# EAGLE board IceCore (EAGLE 7.7.0)
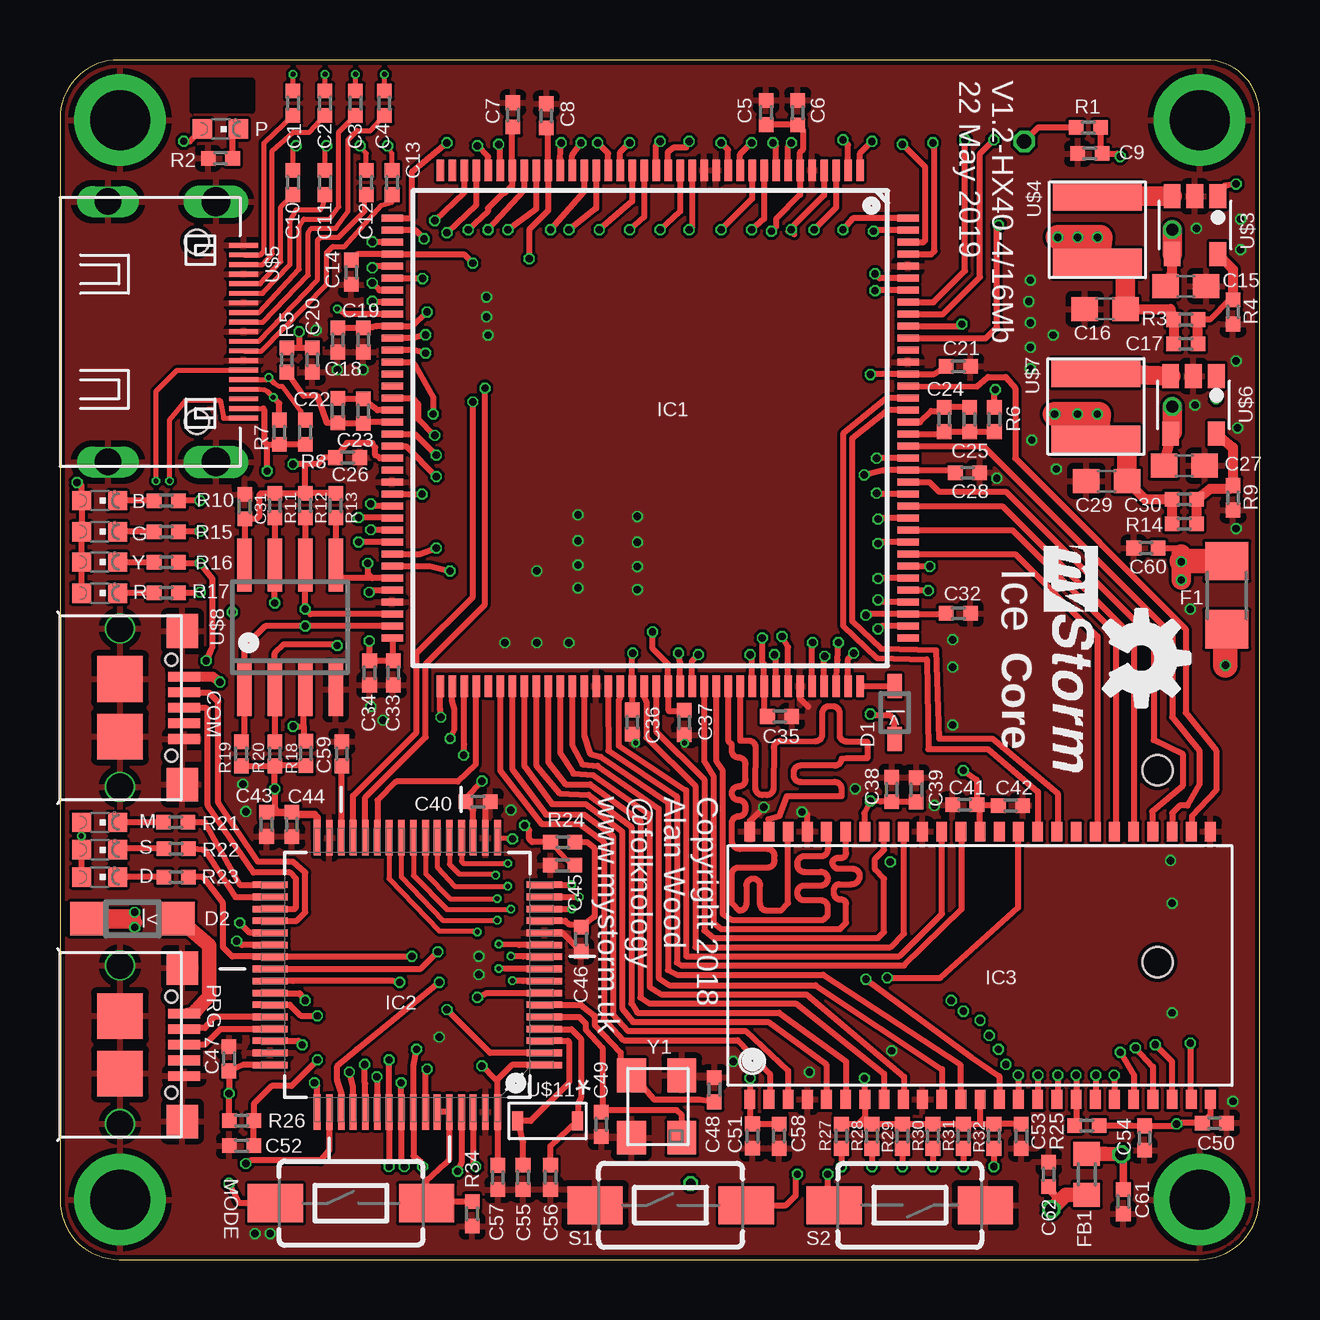
[diagram p2: board, top side]
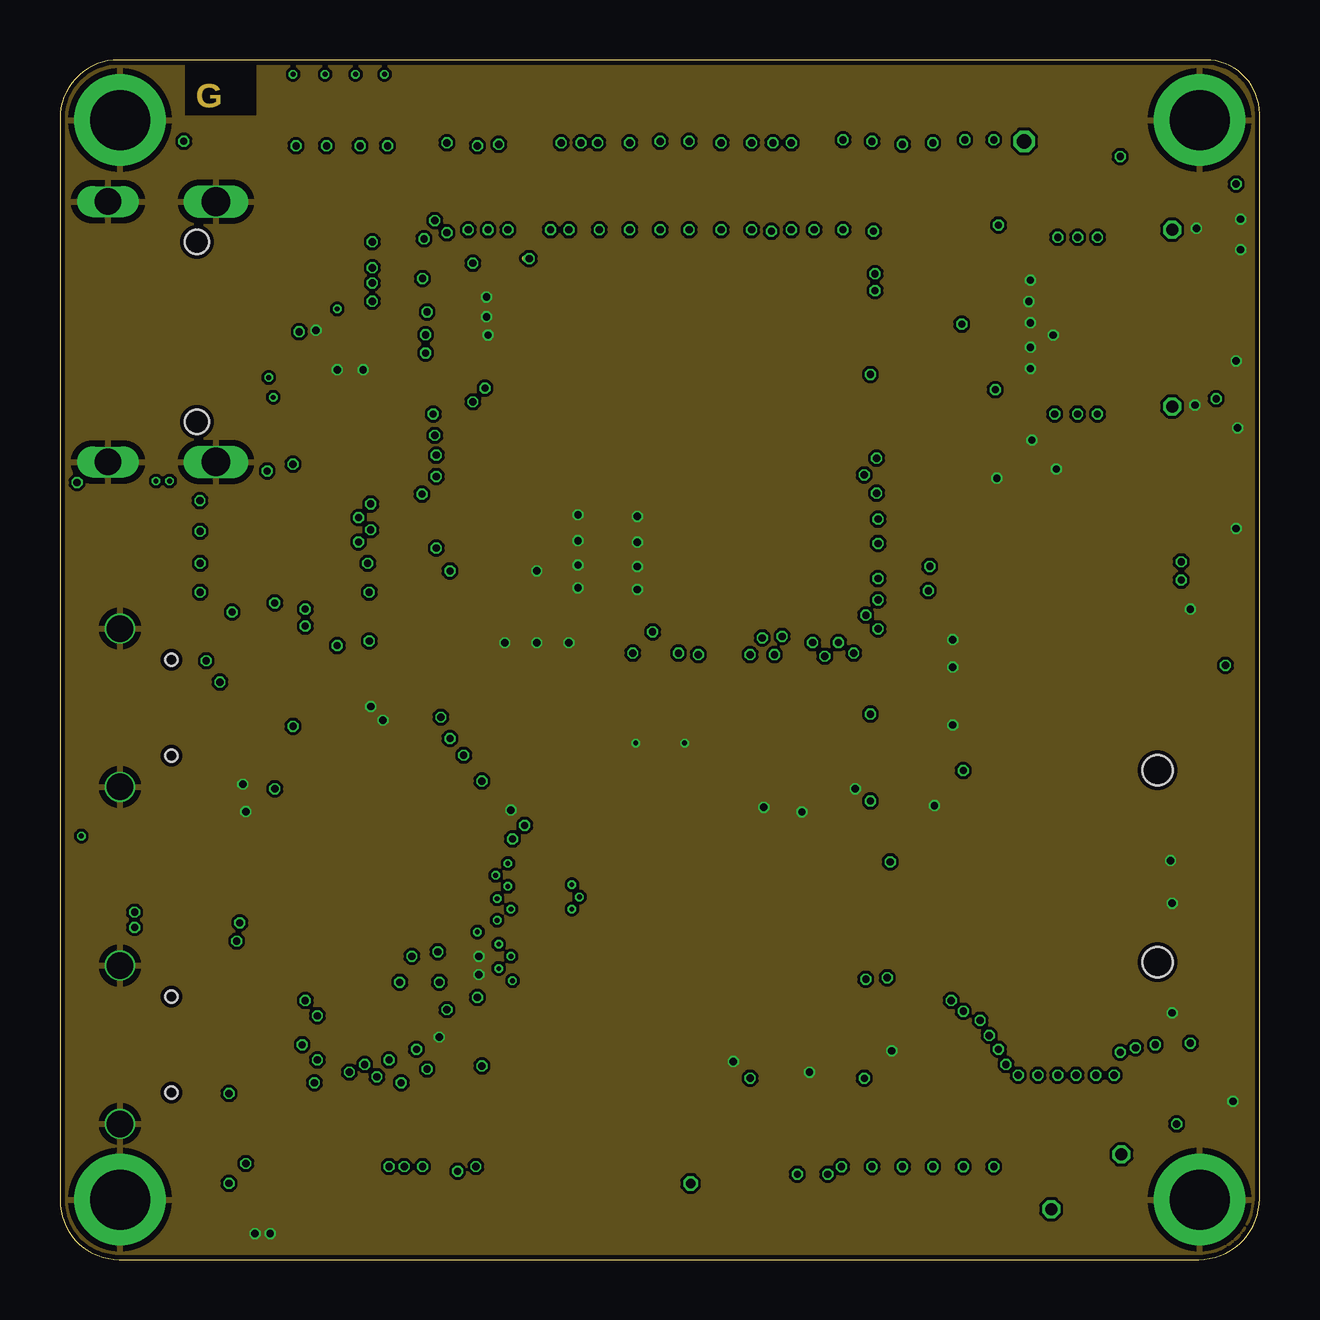
[diagram p3: board, inner layer Route2]
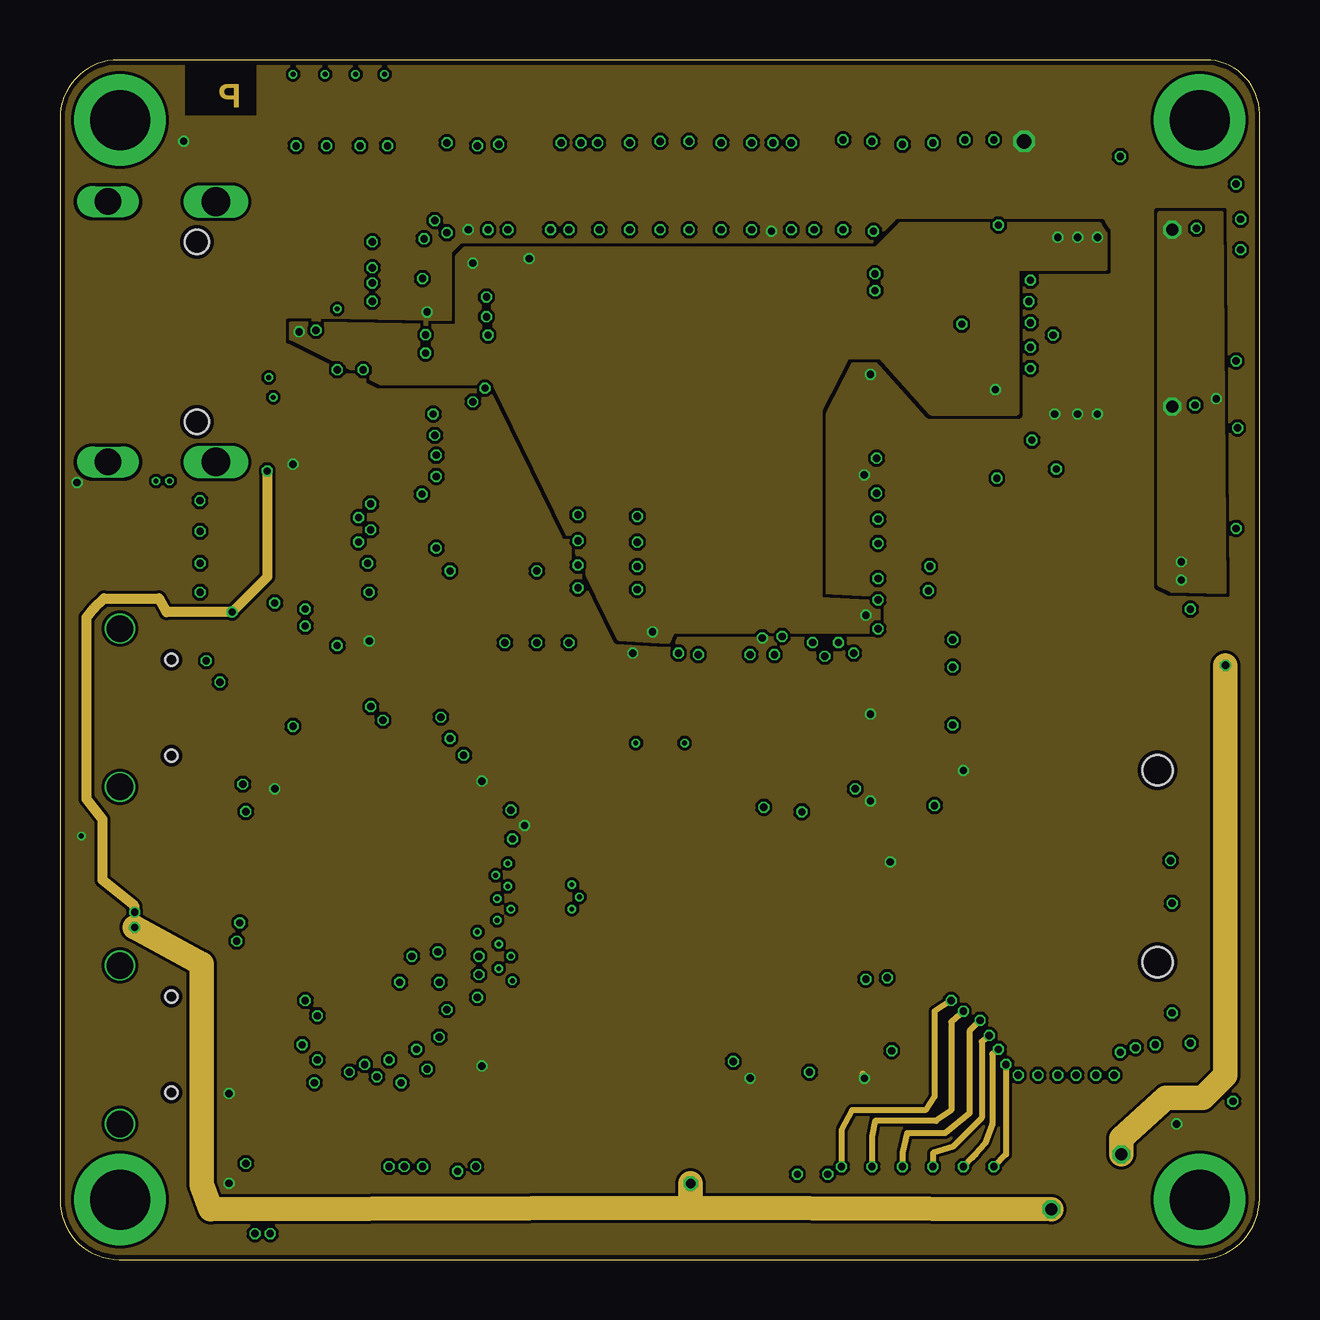
[diagram p4: board, inner layer Route15]
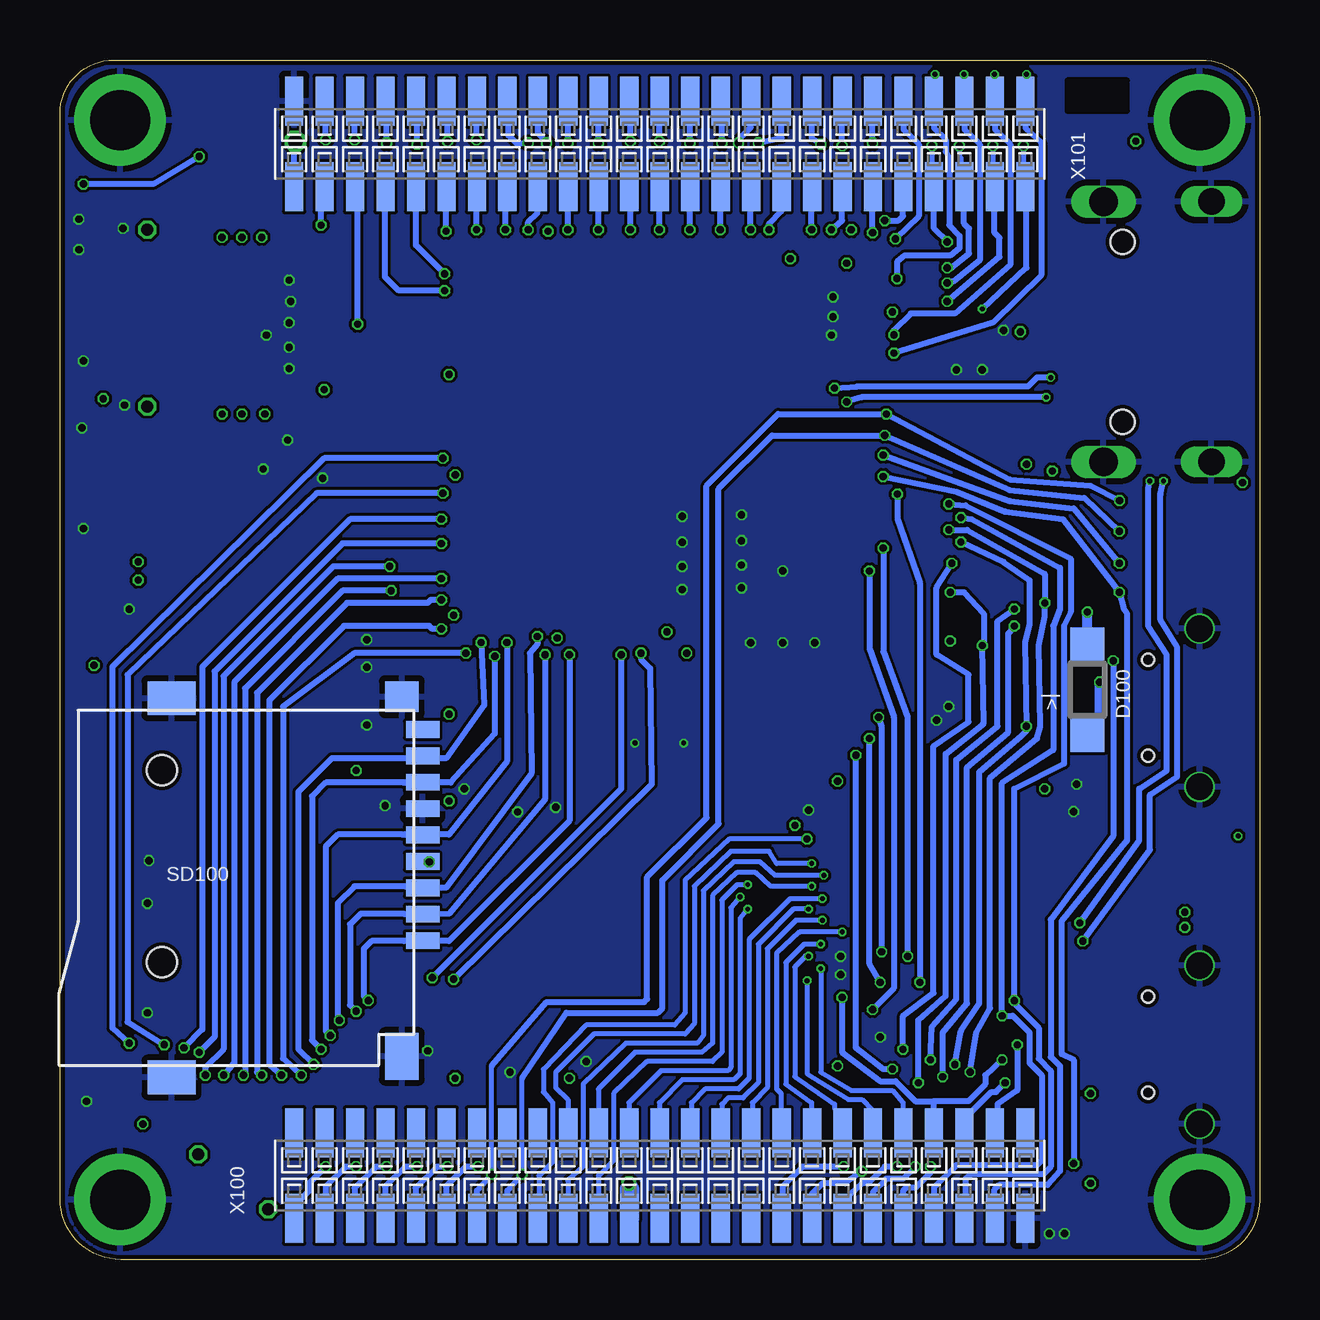
[diagram p5: board, bottom side, seen from below]

Size 50 x 50 mm. Coordinates in mm from the lower left corner, seen from the top.
Outline: 47.76,50 2.44,50 arc90 0,47.56 0,2.47 arc90 2.47,0 47.47,0 arc90 50,2.53 50,47.76 arc90 47.76,50
Copper layers (1*2*15*16): Top 0.035559375mm / dielectric 0.17018125mm / Route2 0.01778125mm / dielectric 47mil / Route15 0.01778125mm / dielectric 0.17018125mm / Bottom 0.035559375mm
Design rules "jcl-4layer": minimum track width 5mil, minimum drill 0.2mm, track to track 5mil, track to pad 5mil, pad to pad 5mil, via to via 5mil, smd to smd 5mil, copper to edge 0.2mm, drill to drill 5mil, minimum pad ring 3mil, minimum via ring 3mil, stop-mask expansion 2.5mil, vias tented up to drill 2mm, thermal gap 10mil
Net classes: 2 thin_power: width 0.254 mm
tRestrict: area 5.5,47.9 to 8,49.1
bRestrict: area 5.5,47.9 to 8,49.1

## Footprints (pad centres in the part's own frame; a part is rotated, then mirrored left to right if it is on the bottom)
CHIPLED_0603 = smd 0.8 x 0.8: A 0,-0.75; C 0,0.75
C0402 = smd 0.61 x 0.61: 1 -0.508,0; 2 0.508,0
C0603 = smd 1.1 x 1: 1 -0.85,0; 2 0.85,0
MICROUSB-B-PEG = smd 0.4 x 1.35: P$1 -1.3,2.675; P$2 -0.65,2.675; P$3 0,2.675; P$4 0.65,2.675; P$5 1.3,2.675 | drill 1.1: SH5 -3.3,0; SH6 3.3,0 | smd 1.4 x 1.3: SH@1 -3.2,2.6; SH@4 3.2,2.6 | smd 1.9 x 1.9: SH@2 -1.2,0; SH@3 1.2,0 | hole 0.5: -2,2.15; 2,2.15
SOD-323 = smd 1 x 0.6: A 1.1,0; C -1.1,0
SOD123 = smd 1.4 x 1.4: A 1.9,0; C -1.9,0
R1206 = smd 1.6 x 1.803: 1 -1.422,0; 2 1.422,0
0603 = smd 1 x 1.1: 1 -0.85,0; 2 0.85,0
TQFP144 = smd 0.9 x 0.3: 1 -10.75,8.75; 2 -10.75,8.25; 3 -10.75,7.75; 4 -10.75,7.25; 5 -10.75,6.75; 6 -10.75,6.25; 7 -10.75,5.75; 8 -10.75,5.25; 9 -10.75,4.75; 10 -10.75,4.25; 11 -10.75,3.75; 12 -10.75,3.25; 13 -10.75,2.75; 14 -10.75,2.25; 15 -10.75,1.75; 16 -10.75,1.25; 17 -10.75,0.75; 18 -10.75,0.25; 19 -10.75,-0.25; 20 -10.75,-0.75; 21 -10.75,-1.25; 22 -10.75,-1.75; 23 -10.75,-2.25; 24 -10.75,-2.75; 25 -10.75,-3.25; 26 -10.75,-3.75; 27 -10.75,-4.25; 28 -10.75,-4.75; 29 -10.75,-5.25; 30 -10.75,-5.75; 31 -10.75,-6.25; 32 -10.75,-6.75; 33 -10.75,-7.25; 34 -10.75,-7.75; 35 -10.75,-8.25; 36 -10.75,-8.75; 73 10.75,-8.75; 74 10.75,-8.25; 75 10.75,-7.75; 76 10.75,-7.25; 77 10.75,-6.75; 78 10.75,-6.25; 79 10.75,-5.75; 80 10.75,-5.25; 81 10.75,-4.75; 82 10.75,-4.25; 83 10.75,-3.75; 84 10.75,-3.25; 85 10.75,-2.75; 86 10.75,-2.25; 87 10.75,-1.75; 88 10.75,-1.25; 89 10.75,-0.75; 90 10.75,-0.25; 91 10.75,0.25; 92 10.75,0.75; 93 10.75,1.25; 94 10.75,1.75; 95 10.75,2.25; 96 10.75,2.75; 97 10.75,3.25; 98 10.75,3.75; 99 10.75,4.25; 100 10.75,4.75; 101 10.75,5.25; 102 10.75,5.75; 103 10.75,6.25; 104 10.75,6.75; 105 10.75,7.25; 106 10.75,7.75; 107 10.75,8.25; 108 10.75,8.75 | smd 0.3 x 0.9: 37 -8.75,-10.75; 38 -8.25,-10.75; 39 -7.75,-10.75; 40 -7.25,-10.75; 41 -6.75,-10.75; 42 -6.25,-10.75; 43 -5.75,-10.75; 44 -5.25,-10.75; 45 -4.75,-10.75; 46 -4.25,-10.75; 47 -3.75,-10.75; 48 -3.25,-10.75; 49 -2.75,-10.75; 50 -2.25,-10.75; 51 -1.75,-10.75; 52 -1.25,-10.75; 53 -0.75,-10.75; 54 -0.25,-10.75; 55 0.25,-10.75; 56 0.75,-10.75; 57 1.25,-10.75; 58 1.75,-10.75; 59 2.25,-10.75; 60 2.75,-10.75; 61 3.25,-10.75; 62 3.75,-10.75; 63 4.25,-10.75; 64 4.75,-10.75; 65 5.25,-10.75; 66 5.75,-10.75; 67 6.25,-10.75; 68 6.75,-10.75; 69 7.25,-10.75; 70 7.75,-10.75; 71 8.25,-10.75; 72 8.75,-10.75; 109 8.75,10.75; 110 8.25,10.75; 111 7.75,10.75; 112 7.25,10.75; 113 6.75,10.75; 114 6.25,10.75; 115 5.75,10.75; 116 5.25,10.75; 117 4.75,10.75; 118 4.25,10.75; 119 3.75,10.75; 120 3.25,10.75; 121 2.75,10.75; 122 2.25,10.75; 123 1.75,10.75; 124 1.25,10.75; 125 0.75,10.75; 126 0.25,10.75; 127 -0.25,10.75; 128 -0.75,10.75; 129 -1.25,10.75; 130 -1.75,10.75; 131 -2.25,10.75; 132 -2.75,10.75; 133 -3.25,10.75; 134 -3.75,10.75; 135 -4.25,10.75; 136 -4.75,10.75; 137 -5.25,10.75; 138 -5.75,10.75; 139 -6.25,10.75; 140 -6.75,10.75; 141 -7.25,10.75; 142 -7.75,10.75; 143 -8.25,10.75; 144 -8.75,10.75
QFP50P1200X1200X160-64N = smd 1.473 x 0.279: 1 -5.715,3.759; 2 -5.715,3.251; 3 -5.715,2.743; 4 -5.715,2.261; 5 -5.715,1.753; 6 -5.715,1.245; 7 -5.715,0.762; 8 -5.715,0.254; 9 -5.715,-0.254; 10 -5.715,-0.762; 11 -5.715,-1.245; 12 -5.715,-1.753; 13 -5.715,-2.261; 14 -5.715,-2.743; 15 -5.715,-3.251; 16 -5.715,-3.759; 33 5.715,-3.759; 34 5.715,-3.251; 35 5.715,-2.743; 36 5.715,-2.261; 37 5.715,-1.753; 38 5.715,-1.245; 39 5.715,-0.762; 40 5.715,-0.254; 41 5.715,0.254; 42 5.715,0.762; 43 5.715,1.245; 44 5.715,1.753; 45 5.715,2.261; 46 5.715,2.743; 47 5.715,3.251; 48 5.715,3.759 | smd 0.279 x 1.473: 17 -3.759,-5.715; 18 -3.251,-5.715; 19 -2.743,-5.715; 20 -2.261,-5.715; 21 -1.753,-5.715; 22 -1.245,-5.715; 23 -0.762,-5.715; 24 -0.254,-5.715; 25 0.254,-5.715; 26 0.762,-5.715; 27 1.245,-5.715; 28 1.753,-5.715; 29 2.261,-5.715; 30 2.743,-5.715; 31 3.251,-5.715; 32 3.759,-5.715; 49 3.759,5.715; 50 3.251,5.715; 51 2.743,5.715; 52 2.261,5.715; 53 1.753,5.715; 54 1.245,5.715; 55 0.762,5.715; 56 0.254,5.715; 57 -0.254,5.715; 58 -0.762,5.715; 59 -1.245,5.715; 60 -1.753,5.715; 61 -2.261,5.715; 62 -2.743,5.715; 63 -3.251,5.715; 64 -3.759,5.715
TSOP-2-50 = smd 0.45 x 0.8: 1 -9.6,-5.58; 2 -8.8,-5.58; 3 -8,-5.58; 4 -7.2,-5.58; 5 -6.4,-5.58; 6 -5.6,-5.58; 7 -4.8,-5.58; 8 -4,-5.58; 9 -3.2,-5.58; 10 -2.4,-5.58; 11 -1.6,-5.58; 12 -0.8,-5.58; 13 0,-5.58; 14 0.8,-5.58; 15 1.6,-5.58; 16 2.4,-5.58; 17 3.2,-5.58; 18 4,-5.58; 19 4.8,-5.58; 20 5.6,-5.58; 21 6.4,-5.58; 22 7.2,-5.58; 23 8,-5.58; 24 8.8,-5.58; 25 9.6,-5.58; 26 9.6,5.58; 27 8.8,5.58; 28 8,5.58; 29 7.2,5.58; 30 6.4,5.58; 31 5.6,5.58; 32 4.8,5.58; 33 4,5.58; 34 3.2,5.58; 35 2.4,5.58; 36 1.6,5.58; 37 0.8,5.58; 38 0,5.58; 39 -0.8,5.58; 40 -1.6,5.58; 41 -2.4,5.58; 42 -3.2,5.58; 43 -4,5.58; 44 -4.8,5.58; 45 -5.6,5.58; 46 -6.4,5.58; 47 -7.2,5.58; 48 -8,5.58; 49 -8.8,5.58; 50 -9.6,5.58
TACTILE-SWITCH-1101NE = smd 2.3 x 1.6: 1 -3.15,0; 2 3.15,0
R0402 = smd 0.61 x 0.61: 1 -0.508,0; 2 0.508,0
TF-PULL = smd 0.7 x 1.4: 1 -2.2,-7.62; 2 -1.1,-7.62; 3 0,-7.62; 4 1.1,-7.62; 5 2.2,-7.62; 6 3.3,-7.62; 7 4.4,-7.62; 8 5.5,-7.62; 9 6.6,-7.62 | smd 1.4 x 2: S1 -7.9,2.85; S2 7.9,2.85 | smd 1.28 x 1.4: S3 7.96,-6.75 | smd 1.95 x 1.4: S4 -7.025,-6.75 | hole 1.25: -3.1,3.25; 4.9,3.25
2.5MM-HOLE = drill 2.5 pad 3.81: P$1 0,0
TSOP-5/SOT23-5 = smd 0.7 x 1: 1 0.95,1.2; 2 0,1.2; 3 -0.95,1.2; 4 -0.95,-1.2; 5 0.95,-1.2
NRC4018 = smd 1.2 x 3.7: P$1 -1.4,0; P$2 1.4,0
MINI-HDMI = smd 0.2 x 1.2: P$1 -3.6,3.525; P$2 -3.2,3.525; P$3 -2.8,3.525; P$4 -2.4,3.525; P$5 -2,3.525; P$6 -1.6,3.525; P$7 -1.2,3.525; P$8 -0.8,3.525; P$9 -0.4,3.525; P$10 0,3.525; P$11 0.4,3.525; P$12 0.8,3.525; P$13 1.2,3.525; P$14 1.6,3.525; P$15 2,3.525; P$16 2.4,3.525; P$17 2.8,3.525; P$18 3.2,3.525; P$19 3.6,3.525 | drill 1.2 pad 1.35 long: P$20 -5.425,2.375; P$21 5.425,2.375 | drill 1.1 pad 1.3 long: P$22 -5.425,-2.125; P$23 5.425,-2.125 | hole 1: -3.75,1.575; 3.75,1.575
SOIC-8-NARROW = smd 0.6 x 2.2: 1 -1.905,-2.6; 2 -0.635,-2.6; 3 0.635,-2.6; 4 1.905,-2.6; 5 1.905,2.6; 6 0.635,2.6; 7 -0.635,2.6; 8 -1.905,2.6
FC135 = smd 0.45 x 0.8: P$1 -1.25,0; P$2 1.25,0
1296-50 = smd 0.76 x 2.05: 1 -15.24,-1.78; 2 -15.24,1.78; 3 -13.97,-1.78; 4 -13.97,1.78; 5 -12.7,-1.78; 6 -12.7,1.78; 7 -11.43,-1.78; 8 -11.43,1.78; 9 -10.16,-1.78; 10 -10.16,1.78; 11 -8.89,-1.78; 12 -8.89,1.78; 13 -7.62,-1.78; 14 -7.62,1.78; 15 -6.35,-1.78; 16 -6.35,1.78; 17 -5.08,-1.78; 18 -5.08,1.78; 19 -3.81,-1.78; 20 -3.81,1.78; 21 -2.54,-1.78; 22 -2.54,1.78; 23 -1.27,-1.78; 24 -1.27,1.78; 25 0,-1.78; 26 0,1.78; 27 1.27,-1.78; 28 1.27,1.78; 29 2.54,-1.78; 30 2.54,1.78; 31 3.81,-1.78; 32 3.81,1.78; 33 5.08,-1.78; 34 5.08,1.78; 35 6.35,-1.78; 36 6.35,1.78; 37 7.62,-1.78; 38 7.62,1.78; 39 8.89,-1.78; 40 8.89,1.78; 41 10.16,-1.78; 42 10.16,1.78; 43 11.43,-1.78; 44 11.43,1.78; 45 12.7,-1.78; 46 12.7,1.78; 47 13.97,-1.78; 48 13.97,1.78; 49 15.24,-1.78; 50 15.24,1.78
CRYSTAL-3.2X2.5 = smd 1.4 x 1.2: 1 -1.3,-1; 2 1.3,-1; 3 1.3,1.1; 4 -1.3,1.1

## Placement (x,y rotation side)
B  [CHIPLED_0603]  1.65,31.63 270 top
C1  220nf  [C0402]  9.72,48.2 270 top
C2  220nf  [C0402]  11.05,48.2 270 top
C3  220nf  [C0402]  12.32,48.2 270 top
C4  220nf  [C0402]  13.53,48.2 90 top
C5  4u7  [C0402]  29.43,47.81 90 top
C6  100nf  [C0402]  30.75,47.81 90 top
C7  100nf  [C0402]  18.88,47.71 270 top
C8  100nf  [C0402]  20.27,47.67 90 top
C9  100nf  [C0402]  42.93,46.1 0 top
C10  220nf  [C0402]  9.72,44.89 270 top
C11  220nf  [C0402]  11.05,44.89 270 top
C12  220nf  [C0402]  12.76,44.89 270 top
C13  220nf  [C0402]  13.84,44.89 270 top
C14  100nf  [C0402]  12.14,41.15 270 top
C15  22uf  [C0603]  46.93,40.58 180 top
C16  22uf  [C0603]  43.56,39.62 180 top
C17  22pf  [C0402]  46.93,38.16 180 top
C18  100nf  [C0402]  11.58,38.33 270 top
C19  100nf  [C0402]  12.64,38.33 270 top
C20  4u7  [C0402]  10.52,37.5 270 top
C21  100nf  [C0402]  37.45,37.23 0 top
C22  4u7  [C0402]  11.58,35.38 270 top
C23  100nf  [C0402]  12.64,35.36 90 top
C24  100nf  [C0402]  36.86,35.02 270 top
C25  4u7  [C0402]  37.91,35.02 270 top
C26  100nf  [C0402]  11.99,33.43 0 top
C27  22uf  [C0603]  46.86,33.08 180 top
C28  100nf  [C0402]  37.83,32.79 180 top
C29  22uf  [C0603]  43.62,32.45 180 top
C30  22pf  [C0402]  46.86,31.69 180 top
C31  100nf  [C0402]  7.7,31.39 90 top
C32  100nf  [C0402]  37.45,26.93 180 top
C33  4u7  [C0402]  13.89,24.46 270 top
C34  100nf  [C0402]  12.91,24.46 270 top
C35  100nf  [C0402]  30,22.63 0 top
C36  100nf  [C0402]  23.85,22.4 270 top
C37  100nf  [C0402]  26.02,22.38 270 top
C38  100nf  [C0402]  34.67,19.6 90 top
C39  4u7  [C0402]  35.69,19.58 90 top
C40  100nf  [C0402]  17.43,19.09 180 top
C41  4u7  [C0402]  37.71,18.95 180 top
C42  100nf  [C0402]  39.62,18.92 0 top
C43  4u7  [C0402]  8.61,18.14 90 top
C44  4u7  [C0402]  9.66,18.14 270 top
C45  100nf  [C0402]  20.95,16.43 0 top
C46  100nf  [C0402]  21.72,13.35 90 top
C47  100nf  [C0402]  7.05,8.37 270 top
C48  22pf  [C0402]  27.28,7.08 270 top
C49  22pf  [C0402]  22.56,5.63 90 top
C50  100nf  [C0402]  48.12,5.69 0 top
C51  100nf  [C0402]  28.87,5.15 270 top
C52  100nf  [C0402]  7.57,4.74 180 top
C53  100nf  [C0402]  40.07,5.14 90 top
C54  4u7  [C0402]  45.2,5.06 270 top
C55  22pf  [C0402]  19.3,3.43 90 top
C56  22pf  [C0402]  20.45,3.43 90 top
C57  100nf  [C0402]  18.25,3.42 90 top
C58  4u7  [C0402]  29.97,5.14 270 top
C59  4u7  [C0402]  11.75,21.08 90 top
C60  100nf  [C0402]  45.27,29.65 0 top
C61  100nf  [C0402]  44.32,2.41 90 top
C62  100nf  [C0402]  41.21,3.56 270 top
COM  FCI-MICROUSB-B-PEG  [MICROUSB-B-PEG]  2.5,23 270 top
D  [CHIPLED_0603]  1.65,15.94 270 top
D1  BAS70J  [SOD-323]  34.79,22.8 270 top
D2  [SOD123]  3.02,14.2 0 top
D100  [SOD123]  7.18,23.75 270 bottom
F1  [R1206]  48.63,27.69 90 top
FB1  FERRITE_BEAD  [0603]  42.8,3.56 90 top
G  [CHIPLED_0603]  1.65,30.34 270 top
IC1  ICE40HX4K_TQFP144  [TQFP144]  24.6,34.65 270 top
IC2  STM32F103RET6  [QFP50P1200X1200X160-64N]  14.48,11.86 180 top
IC3  SDRAM  [TSOP-2-50]  38.35,12.26 0 top
M  [CHIPLED_0603]  1.65,18.22 270 top
MODE  [TACTILE-SWITCH-1101NE]  12.13,2.35 0 top
P  Blue  [CHIPLED_0603]  6.69,47.12 270 top
R  [CHIPLED_0603]  1.65,27.77 270 top
R1  10k  [R0402]  42.86,47.18 0 top
R2  1k  [R0402]  6.69,45.9 0 top
R3  120k  [R0402]  46.93,39.18 180 top
R4  120k  [R0402]  48.9,39.5 270 top
R5  100R  [R0402]  9.46,37.5 90 top
R6  100R  [R0402]  38.95,35.02 270 top
R7  10k  [R0402]  9.14,34.48 90 top
R8  10k  [R0402]  10.22,34.48 90 top
R9  27k  [R0402]  48.9,31.75 270 top
R10  1K  [R0402]  4.44,31.63 0 top
R11  10k  [R0402]  8.95,31.43 270 top
R12  10k  [R0402]  10.22,31.43 270 top
R13  10k  [R0402]  11.49,31.43 270 top
R14  120k  [R0402]  46.86,30.67 180 top
R15  1K  [R0402]  4.44,30.33 0 top
R16  1k  [R0402]  4.44,29.06 0 top
R17  1k  [R0402]  4.44,27.79 0 top
R18  10k  [R0402]  10.25,21.09 90 top
R19  10k  [R0402]  7.56,21.08 90 top
R20  10k  [R0402]  8.95,21.08 90 top
R21  1K  [R0402]  4.83,18.22 180 top
R22  1K  [R0402]  4.84,17.13 180 top
R23  1K  [R0402]  4.84,15.94 180 top
R24  100R  [R0402]  20.95,17.4 0 top
R25  10k  [R0402]  42.8,5.59 0 top
R26  10k  [R0402]  7.57,5.79 180 top
R27  10k  [R0402]  32.58,5.14 90 top
R28  10k  [R0402]  33.85,5.14 90 top
R29  10k  [R0402]  35.12,5.14 90 top
R30  10k  [R0402]  36.39,5.14 90 top
R31  10k  [R0402]  37.66,5.14 90 top
R32  10k  [R0402]  38.93,5.14 90 top
R34  27k  [R0402]  17.18,1.9 270 top
S  [CHIPLED_0603]  1.65,17.08 270 top
S1  [TACTILE-SWITCH-1101NE]  25.45,2.26 0 top
S2  [TACTILE-SWITCH-1101NE]  35.42,2.26 180 top
SD100  TF-HOLDER  [TF-PULL]  42.5,15.49 90 bottom
U$1  HOLE-2.5MM  [2.5MM-HOLE]  2.5,47.5 0 top
U$2  HOLE-2.5MM  [2.5MM-HOLE]  47.5,47.5 0 top
U$3  [TSOP-5/SOT23-5]  47.31,43.12 0 top
U$4  NRS4018  [NRC4018]  43.24,42.93 270 top
U$5  HD10-001_HDMIMINI-HDMI  [MINI-HDMI]  4.13,38.67 270 top
U$6  [TSOP-5/SOT23-5]  47.24,35.62 0 top
U$7  NRS4018  [NRC4018]  43.18,35.56 270 top
U$8  AT25SDF041A  [SOIC-8-NARROW]  9.59,26.35 0 top
U$10  FCI-MICROUSB-B-PEG  [MICROUSB-B-PEG]  2.5,8.95 270 top
U$11  FC-135  [FC135]  20.32,5.78 180 top
U$12  HOLE-2.5MM  [2.5MM-HOLE]  2.5,2.5 0 top
U$13  HOLE-2.5MM  [2.5MM-HOLE]  47.5,2.5 0 top
X100  1296-T50  [1296-50]  25,3.5 180 bottom
X101  1296-T50  [1296-50]  25,46.5 180 bottom
Y  [CHIPLED_0603]  1.65,29.07 270 top
Y1  12MZ  [CRYSTAL-3.2X2.5]  24.92,6.38 90 top

## Tracks (layer width: path | path; a pad name or v marks a point on that pad's centre or on a via)
2V5
  Top 0.256: IC1.108 D1.C
!CAS  (via drill 0.3)
  Top 0.254: IC1.110 34.21,26.4 v34.1,26.29 | v40.77,7.68 40.77,6.69 IC3.16
  Bottom 0.254: v34.1,26.29 34.48,26.29 34.61,26.42 38.16,26.42 41.27,23.3 41.27,8.13 v40.77,7.68
!CS  (via drill 0.3)
  Top 0.254: IC1.56 14.42,33.9 v15.68,32.64 | v5.84,27.81 5.75,27.79 R17.2 | IC2.50 11.23,4.56 10.86,4.13 7.94,4.13 v7.75,4
  Bottom 0.254: v15.68,32.64 12.64,32 10.6,31.18 8.19,30.86 v5.84,27.81 5.65,27.11 5.52,26.92 5.52,17.46 8.26,14.1 8.26,8.57 7.75,8.32 v7.75,4
!DCS  (via drill 0.3)
  Top 0.254: IC2.58 15.24,7.87 v15.3,7.94 | v16.83,21.02 16.85,21.49 IC1.75
  Bottom 0.254: v15.3,7.94 15.68,7.94 16.83,8.83 v16.83,21.02
!MCS  (via drill 0.3)
  Top 0.254: IC1.113 36.09,27.9 v36.2,27.88 | v42.35,7.68 IC3.18
  Top 0.256: IC3.18 42.35,5.71 R25.1
  Bottom 0.254: v36.2,27.88 38.23,27.88 42.29,23.81 42.29,7.75 v42.35,7.68
!RAS  (via drill 0.3)
  Top 0.254: IC1.112 34.2,27.4 v34.1,27.5 | v41.59,7.68 41.59,6.71 IC3.17
  Bottom 0.254: v34.1,27.5 34.54,27.5 34.67,27.37 38.04,27.37 41.78,23.62 41.78,7.81 v41.59,7.68
!RST/SWDIO  (via drill 0.3)
  Top 0.254: IC2.46 9.93,9.12 v10.1,8.95
  Bottom 0.254: v10.1,8.95 10.1,7.05 10.92,6.48 10.92,5.39 X100.3 10.99,5.32
!SRST  (via drill 0.3)
  Top 0.254: IC2.7 17.77,11.1 v17.4,10.92 | v10.73,8.32 9.65,7.24 8.83,7.24 8.08,6.49 R26.1 C52.1
  Bottom 0.254: v17.4,10.92 17.4,8.64 15.81,7.43 15.18,7.43 14.35,6.6 13.59,6.6 | 13.59,6.6 13.59,5.3 X100.7 | v10.73,8.32 11.43,7.68 11.43,7.3 12.13,6.6 13.59,6.6
!SS  (via drill 0.3)
  Top 0.254: IC1.71 v10.22,26.4 8.56,26.4 7.68,25.53 U$8.1 7.68,21.78 R19.2 | IC2.54 13.23,7.47 v13.21,7.62
  Bottom 0.254: v13.21,7.62 13.21,9.46 12.19,10.67 12.19,20.51 10.48,21.97 10.48,26.08 v10.22,26.4
!WE  (via drill 0.3)
  Top 0.254: IC1.107 32.85,25.04 v33.08,25.27 | v39.94,7.68 IC3.15
  Bottom 0.254: v33.08,25.27 37.72,25.27 40.7,23.05 40.7,8.38 v39.94,7.68
+3V3  (via drill 0.2, 0.3, 0.6)
  Top 0.2: 21.35,16.43 R24.1
  Top 0.254: U$8.8 7.7,28.97 C31.1 8.21,30.88 8.32,30.99 8.32,31.88 8.38,31.94 R11.1 R12.1 | IC2.19 17.22,18.72 C40.2 16.92,19.27 v17.59,19.94 | C57.2 18.24,4.17 IC2.64 18.22,6.16 18.22,7.49 | IC2.48 7.6,8.1 C47.2 v7.05,6.92 7.06,6.91 R26.2 | R.A Y.A G.A B.A 0.9,32.26 v0.71,32.39 | IC1.57 13.34,33.4 13.14,33.53 13.14,33.85 13.02,34.04 11.96,34.04 C26.1 11.01,33.43 10.73,33.15 10.22,33.15 | IC2.1 18.84,8.1 18.22,7.49 | R13.1 R12.1 | 10.22,33.15 v9.71,33.15 | R12.1 10.22,33.15 | C34.1 12.91,25.76 v12.89,25.78 | 18.22,7.49 18.16,7.49 v17.59,8.06 | 9.14,18.64 8.95,18.84 v8.95,19.62 R20.1 | R19.1 R20.1 | R18.1 8.96,20.58 R20.1 | C45.2 21.35,16.43 | R24.1 19.68,17.4 19.56,17.53 19.56,17.91 v19.37,18.1 | MODE.1 7.49,2.35 v7.05,3.17 | IC3.1 28.75,5.77 C51.1 C58.1 | IC3.44 33.54,17.84 33.53,17.84 | IC3.25 47.95,6.03 C50.1 46.58,5.69 v46.54,5.65 | v5.16,46.61 5.42,46.61 P.A | C18.1 C19.1 | D.A S.A 0.89,17.09 v0.89,17.65 M.A | v33.53,7.56 33.55,7.53 IC3.7 33.55,5.93 33.27,5.65
  Top 0.256: C36.1 IC1.89 23.85,25.25 v23.88,25.27 | C35.1 29.35,22.77 IC1.100 29.35,24.82 29.27,24.89 v29.27,25.91 | C28.2 37.22,32.9 IC1.123 34.36,32.9 v33.53,32.7 | C21.1 36.42,36.9 IC1.131 v33.79,36.9 v33.78,36.89 | C7.2 18.85,47.17 IC1.30 18.85,44.76 18.54,44.45 18.48,44.45 17.84,43.81 17.84,43.69 v17.02,42.93 | C34.1 C33.1 13.89,25.86 IC1.72 | IC3.38 38.35,18.82 C41.1 | C42.1 38.25,18.92 C41.1 | 32.51,5.71 R27.2 33.27,5.65 R28.2 R29.2 R30.2 R31.2 38.35,5.65 | C19.1 13.02,38.86 13.18,38.9 IC1.46 14.71,38.9 v15.3,39.5 | v29.65,42.86 29.84,43.05 29.84,43.37 30.85,44.38 IC1.6 30.85,46.15 30.99,46.29 30.99,47.06 C6.1 29.69,47.3 C5.1 | D1.A 34.79,22.49 34.61,22.67 33.84,22.67 v33.78,22.73 | v37.65,20.38 38.22,19.99 C41.1 | C39.1 34.78,19.07 C38.1 34.2,19.09 v33.78,19.11 33.53,18.61 33.53,17.84 33.53,17.65 | R25.2 44.68,5.59 C54.1 46.47,5.57 v46.54,5.65 46.56,5.67 | R1.1 40.77,47.18 v40.2,46.61 | v28.77,7.56 28.75,7.61 IC3.1 | IC3.13 38.35,5.65 | 38.35,5.65 R32.2 C53.2
  Top 0.305: IC2.32 10.72,18.43 10.6,18.54 9.64,18.54 C44.1 9.14,18.64 8.81,18.64 C43.2
  Top 0.406: C29.1 45.24,31.69 C30.2 R14.2
  Top 0.813: 44.58,34.16 44.32,34.16 | 44.32,34.16 43.31,34.16 U$7.P$2 | C29.1 44.47,33.76 44.32,34.16
  Top 1.016: U$7.P$2 43.31,35.24 v41.47,35.24
  Route15 0.254: v33.53,7.56 33.53,7.68 33.47,7.75
  Bottom 0.254: X101.50 40.24,46.56 v40.2,46.61
  Bottom 0.256: SD100.4 34.63,16.59 v34.61,16.57
  other vias: 43.24,35.24 42.42,35.24
  pour Route15 (rank 2): 50,0 0,0 0,50 5.14,50 5.14,47.62 8.26,47.62 8.26,49.97 50,50
+5V  (via drill 0.3, 0.5)
  Top 0.254: C60.2 46.61,29.65 46.61,29.21 v46.74,29.08
  Top 0.256: U$6.1 48.19,36.32 v48.2,35.88
  Top 0.406: C27.2 46.35,34.49 U$6.4 | C15.2 46.35,41.15 U$3.4
  Top 0.813: v46.74,28.32 v46.74,29.08 | v46.74,29.08 46.74,29.4 | 46.77,29.11 v46.74,29.08 | 46.35,34.49 v46.35,35.56 | U$3.4 46.36,42.73 v46.35,42.93
  Top 1.016: F1.2 46.77,29.11
  pour Route15: 48.39,43.62 48.51,27.81 46.35,27.88 45.85,28.13 45.85,43.62
A0  (via drill 0.3)
  Top 0.254: IC1.117 34.16,29.9 v34.1,29.84 | v44.2,8.64 44.77,7.68 44.77,6.69 IC3.21
  Bottom 0.254: v34.1,29.84 38.23,29.84 43.56,24.51 43.56,9.27 v44.2,8.64
A1  (via drill 0.3)
  Top 0.254: IC1.119 34.14,30.9 v34.1,30.86 | IC3.22 45.55,8.04 v44.83,8.83
  Bottom 0.254: v34.1,30.86 37.91,30.86 44.07,24.7 44.07,9.59 v44.83,8.83
A2  (via drill 0.3)
  Top 0.254: IC1.121 34.08,31.9 v34.04,31.94 | IC3.23 46.35,8.26 v45.66,8.95
  Bottom 0.254: v34.04,31.94 39.31,31.94 47.18,24.38 47.18,9.91 v45.66,8.95
A3  (via drill 0.3)
  Top 0.254: IC1.124 v34.04,33.4 | IC3.24 47.12,6.71 v47.12,9.02
  Bottom 0.254: v34.04,33.4 38.99,33.4 47.82,24.7 47.82,9.65 v47.12,9.02
A4
  Top 0.254: IC1.130 38.23,36.39 38.69,36.78 39.42,36.78 39.81,36.32 39.81,33.4 46.93,26.29 46.93,22.8 48.2,21.21 48.2,19.56 47.18,18.48 47.18,17.86 IC3.27
A5
  Top 0.254: IC1.125 38.49,33.9 46.35,26.04 46.35,22.61 47.5,21.21 47.5,19.81 46.99,18.92 46.67,18.92 46.35,18.61 IC3.28
A6
  Top 0.254: IC1.122 36.24,32.4 36.64,32 39.43,32 45.59,25.84 45.59,21.65 46.8,21.08 46.8,19.75 45.53,18.67 IC3.29
A7
  Top 0.254: IC1.120 39.27,31.4 44.77,25.91 44.77,17.85 IC3.30
A8
  Top 0.254: IC1.118 39.7,30.4 44.01,26.1 44.01,17.89 IC3.31
A9
  Top 0.254: IC1.116 39.81,29.4 43.24,25.97 43.24,17.93 IC3.32
A10  (via drill 0.3)
  Top 0.254: IC1.115 v36.25,28.9 v36.26,28.89 | v43.94,7.68 IC3.20
  Bottom 0.254: v36.26,28.89 38.61,28.89 43.18,24.32 43.18,8.76 43.94,8 v43.94,7.68
A11  (via drill 0.3)
  Top 0.254: IC1.114 34.12,28.4 v34.1,28.38 | v43.18,7.68 43.18,6.7 IC3.19
  Bottom 0.254: v34.1,28.38 38.42,28.38 42.74,24.07 42.74,8.19 v43.18,7.68
AN0  (via drill 0.2)
  Top 0.254: IC2.9 18.55,12.12 v18.29,12.13
  Bottom 0.2: v18.29,12.13 18.29,7.81 17.02,7.05 15.3,7.05 14.86,6.54 14.86,5.3
  Bottom 0.254: 14.86,5.3 X100.9
AN1  (via drill 0.2)
  Top 0.254: IC2.8 19.32,11.61 v18.86,11.62
  Bottom 0.2: v18.86,11.62 18.86,7.75 17.14,6.67 16.57,6.67 16.13,6.22 16.13,5.3
  Bottom 0.254: 16.13,5.3 X100.11
AN2  (via drill 0.2)
  Top 0.254: IC2.10 19.32,12.63 v18.8,12.64
  Bottom 0.2: 18.92,12.64 19.37,12.19 19.37,7.62 17.72,6.48 17.72,6.29 17.4,5.97 17.4,5.3
  Bottom 0.254: v18.8,12.64 18.92,12.64 | 17.4,5.3 X100.13
AN3  (via drill 0.2)
  Top 0.254: IC2.11 19.14,13.11 v18.29,13.14
  Bottom 0.2: v18.29,13.14 18.99,13.14 19.75,12.38 19.75,7.3 18.67,6.54 18.67,5.3
  Bottom 0.254: 18.67,5.3 X100.15
AN4  (via drill 0.2)
  Top 0.2: IC2.26 13.72,15.88 15.81,13.69 17.21,13.69 v17.4,13.65
  Bottom 0.2: v17.4,13.65 19.18,13.65 20.13,12.76 20.13,7.11 19.94,6.92 19.94,5.3
  Bottom 0.254: 19.94,5.3 X100.17
AN5  (via drill 0.2)
  Top 0.2: IC2.25 14.22,15.94 15.94,14.14 v18.22,14.14
  Bottom 0.2: v18.22,14.14 19.32,14.14 20.51,12.95 20.51,7.18 21.14,6.54 21.14,5.32
  Bottom 0.254: 21.14,5.32 X100.19
AN6  (via drill 0.2)
  Top 0.2: IC2.24 14.73,16 16.13,14.59 18.73,14.59
  Top 0.254: 18.73,14.59 v18.8,14.61
  Bottom 0.2: v18.8,14.61 19.43,14.61 20.89,13.14 20.89,7.37 21.53,6.73 22.16,6.73 22.42,6.48 22.42,5.32
  Bottom 0.254: 22.42,5.32 X100.21
AN7  (via drill 0.2)
  Top 0.2: IC2.23 15.24,16.07 16.26,15.04 v18.22,15.04
  Bottom 0.2: v18.22,15.04 19.57,15.04 21.27,13.34 21.27,7.56 21.72,7.11 23.11,7.11 23.69,6.54 23.69,5.32
  Bottom 0.254: 23.69,5.32 X100.23
AN8  (via drill 0.2)
  Top 0.254: IC2.14 21.27,14.61 v21.34,14.61
  Bottom 0.2: v21.34,14.61 21.65,14.22 21.65,7.75 21.91,7.49 24.07,7.49 25.02,6.54 25.02,5.3
  Bottom 0.254: 25.02,5.3 X100.25
AN9  (via drill 0.2)
  Top 0.254: IC2.15 21.59,15.12 v21.65,15.11
  Bottom 0.2: v21.65,15.11 22.04,14.67 22.04,8 22.16,7.87 24.96,7.87 26.29,6.54 26.29,5.3
  Bottom 0.254: 26.29,5.3 X100.27
AN10  (via drill 0.2)
  Top 0.254: IC2.16 21.27,15.62 v21.34,15.62
  Bottom 0.2: v21.34,15.62 21.78,15.62 22.42,14.99 22.42,8.64 22.8,8.26 25.53,8.26 26.92,6.92 26.92,4.13 27.56,3.49 27.56,1.96
  Bottom 0.406: 27.56,1.96 27.54,1.96 X100.30
AN11  (via drill 0.2)
  Top 0.2: IC2.22 15.72,16.34 16.45,15.56 v18.67,15.56
  Bottom 0.2: v18.67,15.56 20.38,15.56 21.02,16.13 21.78,16.13 22.8,15.18 22.8,9.02 23.24,8.64 26.04,8.64 27.56,7.11 27.56,5.3
  Bottom 0.254: 27.56,5.3 X100.29
AN12  (via drill 0.2)
  Top 0.2: IC2.21 16.23,16.47 16.64,16.07 18.03,16.07 v18.16,16.01
  Bottom 0.2: v18.16,16.01 20.2,16.01 20.83,16.57 21.91,16.57 23.18,15.37 23.18,9.34 23.43,9.02 26.42,9.02 28.19,7.3 28.19,3.87 28.83,3.3 28.83,1.83
  Bottom 0.406: 28.83,1.83 28.81,1.83 X100.32
AN13  (via drill 0.2)
  Top 0.2: IC2.20 16.74,16.6 16.83,16.51 v18.67,16.51
  Bottom 0.2: v18.67,16.51 20.13,16.51 20.45,17.02 22.04,17.02 23.56,15.56 23.56,9.84 23.94,9.4 27.75,9.4 29.34,7.81 29.34,7.18 28.83,6.67 28.83,5.3
  Bottom 0.254: 28.83,5.3 X100.31
AN14  (via drill 0.3)
  Top 0.2: IC2.17 18.81,17.58 v18.86,17.53
  Bottom 0.2: v18.86,17.53 22.1,17.53 23.94,15.81 23.94,10.29 24.38,9.78 28.07,9.78 29.84,7.94 29.84,6.99 29.46,6.54 29.46,4.06 30.04,3.49 30.04,1.74
  Bottom 0.406: 30.04,1.74 30.08,1.74 X100.34
AN15
  Bottom 0.256: 30.1,5.3 X100.33
AN19
  Bottom 0.256: 35.18,5.26 X100.41
CEC  (via drill 0.2, 0.3)
  Top 0.2: v4,32.45 4,36.2 4.88,37.07 U$5.P$14
  Top 0.254: IC2.38 7.59,13.11 v7.37,13.27
  Bottom 0.254: v7.37,13.27 4.57,17.08 4.57,19.37 3.43,20.13 3.43,25.53 4.13,26.67 4.13,31.88 v4,32.45
CKE
  Top 0.254: IC1.128 34.51,35.4 33.02,34.23 33.02,26.61 34.23,25.46 36.51,25.4 36.64,21.72 38.86,21.72 41.59,19.43 41.59,17.87 IC3.34
CLK
  Top 0.254: IC1.129 34.44,35.9 32.64,34.42 32.64,26.42 34.04,25.08 36.13,25.02 36.2,21.27 38.67,21.27 40.77,19.49 40.77,17.85 IC3.35
CRX/SCL  (via drill 0.3)
  Top 0.254: IC2.61 16.74,4.03 v16.57,3.68
  Bottom 0.254: v16.57,3.68 17.27,3.17 18.22,3.17 18.65,2.75 X100.16
CTX/SDA  (via drill 0.3)
  Top 0.254: IC2.62 17.22,3.92 v17.34,3.87
  Bottom 0.254: v17.34,3.87 19.05,3.87 19.88,3.05 19.88,1.76 X100.18
DONE  (via drill 0.3)
  Top 0.254: IC1.65 14.99,29.4 v15.68,29.65 | v14.67,12.64 14.72,12.63 IC2.39 7.19,12.63 6.79,13.02 6.79,14.86 5.97,15.94 R23.1
  Bottom 0.254: v15.68,29.65 15.68,25.34 14.67,22.61 v14.67,12.64
DQ0
  Top 0.254: IC1.78 18.35,20.38 20.07,18.16 21.65,18.16 22.67,17.4 22.67,10.03 23.5,9.14 28.26,9.14 29.59,7.75 29.59,6.71 IC3.2
DQ1
  Top 0.254: IC1.79 18.85,20.46 20.26,18.54 21.84,18.54 23.05,17.65 23.05,10.22 23.69,9.53 28.57,9.53 30.35,7.87 IC3.3
DQ2
  Top 0.254: IC1.80 19.35,20.59 20.51,18.99 21.91,18.99 23.43,17.84 23.43,10.48 23.88,9.91 29.53,9.91 31.94,8.13 IC3.5
DQ3
  Top 0.254: IC1.81 19.85,20.6 20.83,19.43 22.04,19.37 23.81,18.03 23.81,10.67 24.07,10.29 29.97,10.29 32.77,8.26 32.77,6.69 IC3.6
DQ4
  Top 0.254: IC1.82 20.35,20.73 21.08,19.81 22.1,19.81 24.19,18.29 24.19,10.92 24.57,10.67 30.67,10.67 34.35,7.75 34.35,7.69 IC3.8
DQ5
  Top 0.254: IC1.83 20.85,21.12 21.4,20.26 22.23,20.19 24.57,18.54 24.57,11.37 25.08,11.05 31.11,11.05 35.18,7.62 35.18,7.21 IC3.9
DQ6
  Top 0.254: IC1.84 21.35,21.45 21.78,20.64 22.42,20.57 24.96,18.8 24.96,11.75 25.4,11.43 31.5,11.43 36.77,7.94 36.77,6.69 IC3.11
DQ7
  Top 0.254: IC1.85 21.85,21.84 22.1,21.08 22.54,20.95 25.34,19.05 25.34,12.06 25.72,11.87 31.81,11.87 37.53,8.13 37.53,6.7 IC3.12
DQ8
  Top 0.254: IC1.87 22.85,23.19 22.86,21.21 25.72,19.3 25.72,12.38 25.91,12.26 35.18,12.26 37.59,14.61 37.59,17.8 IC3.39
DQ9
  Top 0.254: IC1.88 23.35,23.41 23.29,23.3 23.29,21.42 26.1,19.56 26.1,12.64 34.99,12.64 36.77,14.41 36.77,17.82 IC3.40
DQ10
  Top 0.254: IC1.90 24.35,23.46 24.45,23.24 24.45,21.75 26.48,19.75 26.48,13.02 34.61,13.02 35.18,13.59 35.18,17.81 IC3.42
DQ11
  Top 0.254: IC1.91 24.85,22.01 26.86,20 26.86,13.72 27.24,13.4 34.1,13.4 34.35,13.65 34.35,15.88 33.97,16.26 33.97,16.7 34.35,17.08 IC3.43
DQ12
  Top 0.254: IC1.95 26.85,20.77 27.24,20.13 27.24,14.03 27.56,13.78 32.51,13.78 32.77,14.03 32.77,14.84 arc90 32.54,15 arc-90 32.26,15.29 32.26,15.42 arc-90 32.48,15.64 32.99,15.64 arc90 33.34,15.99 33.34,16 arc90 33.05,16.28 32.48,16.28 arc-90 32.19,16.57 32.19,16.57 arc-90 32.54,16.73 arc90 32.77,16.95 32.77,17.82 IC3.45
DQ13
  Top 0.254: IC1.96 27.35,20.78 27.62,20.38 27.62,14.41 28,14.16 31.81,14.16 32,14.35 32,14.69 arc90 31.72,14.97 31.02,14.97 arc-90 30.73,15.26 30.73,15.3 arc-90 31.02,15.59 31.72,15.59 arc90 32,15.88 arc90 31.72,16.16 31.02,16.16 arc-90 30.73,16.45 30.73,16.52 arc-90 31.02,16.81 31.72,16.81 arc90 32,17.09 32,17.79 IC3.46
DQ14
  Top 0.254: IC1.97 27.85,21.62 28,21.46 28,21.21 arc90 28.29,20.92 arc-90 28.57,20.64 28.57,20.01 arc-90 28.29,19.72 arc90 28,19.44 arc90 28.29,19.15 arc-90 28.57,18.87 28.57,18.76 arc-90 28.29,18.48 arc90 28,18.19 28,17.46 arc90 28.35,17.11 29.5,17.11 arc-90 29.78,16.83 29.78,16.63 arc-90 29.5,16.34 28.29,16.34 arc90 28,16.05 28,14.86 28.32,14.54 arc90 28.61,14.83 28.61,15.59 arc-90 28.89,15.88 28.9,15.88 arc-90 29.18,15.59 29.18,14.83 arc90 29.47,14.54 30.04,14.54 30.35,14.86 IC3.48
DQ15
  Top 0.254: IC1.98 28.35,21.62 28.72,21.62 arc-90 29,21.33 28.99,19.65 arc90 29.27,19.36 29.45,19.36 arc90 29.74,19.65 29.75,21.33 arc-90 30.04,21.61 31.49,21.6 arc90 31.77,21.89 31.78,22.78 arc-90 32.07,23.07 32.21,23.07 arc-90 32.5,22.78 32.49,21.88 arc90 32.77,21.6 33.66,21.59 33.66,20.89 32.77,20.89 32.58,20.87 arc-90 32.29,20.59 30.86,20.59 arc90 30.58,20.3 30.58,20.19 arc90 30.86,19.91 32.29,19.91 arc-90 32.58,19.62 32.58,19.3 30.29,19.3 29.97,18.48 29.53,18.35 29.53,17.86 IC3.49
DSCK
  Top 0.254: IC1.76 17.34,23.89 17.34,20.64 16.59,19.93 14.02,19.93 13.23,19.14 IC2.27
EN/SWCLK  (via drill 0.3)
  Top 0.254: IC2.49 10.72,7.25 v10.6,7.37
  Bottom 0.254: 12.32,5.3 X100.5 12.3,5.86 11.18,6.99 10.99,6.99 v10.6,7.37
GND  (via drill 0.2, 0.3)
  Top 0.254: IC2.12 20.95,13.62 C46.1 | IC2.18 17.73,18.88 C40.1
  Top 0.256: IC1.103 30.85,23.38 31.18,23.05 | IC3.50 28.75,18.27 v29.34,18.85 | IC3.47 31.15,18.56 v30.92,18.66
  other vias: 12.95,23.05 19.88,28.7 12.64,37.08 34.67,8.7 31.24,7.81 24,21.53 39.05,32.57 46.35,14.85 37.21,24.69 37.21,22.28 26.04,21.53 28.07,8.26 8.13,1.08 17.46,12.64 15.81,9.27 7.75,18.67 13.46,22.48 18.8,18.73 8.76,1.08 11.56,37.08 10.67,38.73 33.15,19.62 47.12,27.11 48.9,6.59 21.21,25.71 19.88,25.71 18.54,25.71 46.29,16.63 46.35,10.28 40.51,34.15 41.53,32.95 41.4,38.53 49.09,34.66 49.02,37.46 49.21,43.36 49.21,42.09 17.46,11.87 49.02,30.47 24.07,30.98 24.07,29.9 24.07,28.88 24.07,27.93 21.59,31.04 21.59,29.96 21.59,28.95 21.59,27.99 7.62,19.81 17.78,40.12 17.78,39.3 17.84,38.53 37.21,25.84 40.45,40.82 40.39,39.93 40.45,39.04 40.45,38.03 40.45,37.14 47.37,42.98 47.31,35.61 36.45,18.92
  pour Bottom (rank 2): 0,0 0,50 50,50 50,0
  pour Top: 50,0 0,0 0,50 50,50
  pour Route2 (rank 2): 50,-0.06 0,-0.06 0,49.94 5.14,49.94 5.14,47.62 8.26,47.62 8.26,49.97 50,49.94
HOLD  (via drill 0.3)
  Top 0.254: IC2.52 12.22,7.2 v12.06,7.81 | v8.95,27.37 U$8.7 R11.2 | IC1.63 12.97,30.4 v12.95,30.42
  Bottom 0.254: v12.06,7.81 11.81,9.46 11.24,10.48 11.24,20.07 9.27,21.72 9.14,22.23 9.21,25.59 8.95,26.8 v8.95,27.37 8.95,28.57 12.19,30.42 v12.95,30.42
HPD  (via drill 0.2, 0.3)
  Top 0.2: v4.57,32.45 4.57,34.99 5.27,35.81 6.67,35.81 6.81,35.07 U$5.P$19
  Top 0.254: IC2.37 7.91,13.62 v7.49,14.03
  Bottom 0.254: v7.49,14.03 5.02,17.46 5.02,19.62 3.87,20.38 3.87,25.21 4.64,26.42 4.64,32.13 v4.57,32.45
IO0  (via drill 0.3)
  Top 0.254: 15.88,23.88 IC1.73 15.85,22.95 v15.88,22.61 | IC2.40 15.04,12.12 v15.75,12.83
  Bottom 0.254: v15.75,12.83 15.75,22.23 v15.88,22.61
IO1  (via drill 0.3)
  Top 0.254: 16.38,23.87 IC1.74 16.35,23.27 16.45,22.92 16.45,22.1 v16.26,21.72 | IC2.51 11.73,6.93 11.56,7.49 11.56,8.06 12.38,8.76 v15.81,11.56
  Bottom 0.254: v15.81,11.56 16.26,12.32 v16.26,21.72
L0  (via drill 0.3)
  Top 0.254: IC1.49 14.67,37.4 14.8,37.27 15.56,35.94 v15.56,35.24 | v5.83,31.63 R10.2 | S2.2 32,2.53 v32,3.56
  Bottom 0.2: v32,3.56 32,8.06
  Bottom 0.254: v5.83,31.63 7.05,32.26 10.41,32.51 v15.56,35.24 20.07,35.24 23.05,32.26 23.05,18.41 25.53,15.94 25.53,10.86 25.65,10.73 29.72,10.73 32,8.06 | X100.38 32.62,2.88 v32,3.56
L1  (via drill 0.3)
  Top 0.254: IC1.52 14.71,35.9 14.92,35.69 14.92,35.05 v15.62,34.35 15.68,34.29 | v5.84,30.35 5.63,30.33 R15.2 | S1.2 30.26,2.26 30.67,2.67 30.67,3.43 v30.73,3.56
  Bottom 0.2: v30.73,3.56 30.73,7.56
  Bottom 0.254: v5.84,30.35 7.3,31.75 10.41,32.07 v15.62,34.35 20.32,34.35 22.54,32.13 22.54,18.16 24.89,15.81 24.89,11.11 24.89,10.48 25.08,10.29 28.89,10.29 30.73,7.56 | X100.36 31.35,2.88 v30.73,3.56
L3  (via drill 0.3)
  Top 0.254: IC1.55 14.81,34.4 v15.68,33.53 | R16.2 4.99,29.02 v5.84,29.02 6.35,28.38 6.35,25.53 6.29,25.4 v6.1,24.96
  Bottom 0.254: v15.68,33.53 10.41,31.62 7.75,31.3 v5.84,29.02 | v6.1,24.96 6.1,17.65 8.7,14.16 8.7,8.45 8.32,8.06 8.32,3.68 8.83,3.11 10.86,3.11 11.05,2.92 11.05,1.74 X100.4
LDQM  (via drill 0.3)
  Top 0.254: IC1.93 25.85,24.89 v25.78,25.27 | 39.12,6.71 IC3.14 39.15,7.65 37.97,8.45 v33.59,11.68
  Bottom 0.254: v25.78,25.27 25.78,25.02 25.4,24.64 25.34,19.81 v33.59,11.68
MCLK  (via drill 0.3)
  Top 0.254: v14.16,11.56 13.85,11.62 9.84,11.62 9.71,11.61 IC2.41
  Top 0.256: IC1.60 v15.09,31.9
  Bottom 0.256: v15.09,31.9 15.09,30.86 14.16,28.19 v14.16,11.56
MISO  (via drill 0.3)
  Top 0.254: v14.22,7.37 IC2.56 14.22,4.13 v14.35,3.87 | v11.56,25.59 11.49,25.65 9.34,25.65 8.95,25.27 U$8.2 R20.2 | 13.83,27.88 12.95,27.88 v12.89,27.81
  Top 0.255: 13.83,27.88 IC1.68
  Bottom 0.254: v14.22,7.37 14.22,9.97 13.08,10.99 13.08,21.08 11.56,22.29 11.49,22.35 v11.56,25.59 11.49,25.65 11.49,26.92 12.32,27.81 v12.89,27.81 | v14.35,3.87 14.86,3.37 15.56,3.37 16.11,2.81 X100.12
MODE
  Top 0.254: R21.1 6.03,18.22 7.49,15.62 IC2.33
MODE/BOOT
  Top 0.254: IC2.59 IC2.60 16.23,4.19 16.07,4 15.28,3.28 MODE.2 15.34,2.41 R34.1
MOSI  (via drill 0.3)
  Top 0.254: R13.2 U$8.5 11.49,28.38 11.51,28.4 13.02,28.4 | IC1.67 13.02,28.4 | v14.86,8.76 14.73,8.06 IC2.57 14.73,4.32 15.05,4.06 v15.11,3.87 | v12.83,29.02 12.83,28.59 13.02,28.4
  Bottom 0.254: v14.86,8.76 14.86,10.16 13.59,11.11 13.59,21.4 12.13,22.42 12.13,24.38 13.46,25.21 13.46,28 v12.83,29.02 | v15.11,3.87 15.62,3.87 16.32,3.17 16.57,3.17 17.27,2.54 17.27,1.93 X100.14
N$1
  Top 0.254: R2.2 7.2,46.75 P.C
N$2
  Top 0.254: R22.2 2.45,17.13 S.C
N$3
  Top 0.256: IC1.126 36.75,34.4 C24.2 C25.2 R6.2
N$4
  Top 0.254: R21.2 M.C
N$5
  Top 0.254: IC2.4 21.32,9.6 21.72,9.21 21.72,6.73 21.59,6.48 21.59,5.8 U$11.P$1 20.45,4.72 C56.2
N$6
  Top 0.256: C22.1 12.43,35.89 C23.2 13.24,35.4 IC1.53
N$7
  Top 0.254: IC2.6 21.7,10.62 22.29,10.16 22.29,9.78 23.37,8.63 23.37,8.07 23.37,8.06 Y1.3 23.88,7.68 24.77,6.67 26.67,6.67 C48.2
N$8  (via drill 0.3)
  Top 0.256: R1.2 43.37,46.16 C9.2 44.07,46.1 v44.2,45.97 | v49.02,44.83 48.57,44.76 U$3.1
  Bottom 0.256: v44.2,45.97 46.1,44.83 v49.02,44.83
N$9
  Top 0.254: R10.1 B.C
N$10
  Top 0.254: 19.11,5.8 U$11.P$2 | IC2.3 21.17,9.12 21.21,9.08 21.21,7.37 19.62,5.78 U$11.P$2 | C55.2 19.3,4.89 19.11,5.74 U$11.P$2
N$11
  Top 0.254: R15.1 G.C
N$12
  Top 0.254: R16.1 Y.C
N$13  (via drill 0.3)
  Top 0.406: COM.P$1 6.37,24.3 v6.67,24.07
  Bottom 0.406: v6.67,24.07 6.67,22.42 6.79,22.29 6.79,22.23 D100.A
N$14
  Top 0.256: C25.1 C24.1 36.7,35.37 36.32,35.37 35.85,34.9 IC1.127
N$15
  Top 0.254: R17.1 2.41,27.79 R.C
N$16  (via drill 0.3, 0.5)
  Top 0.305: C61.2 44.32,4.3 v44.24,4.38
  Top 0.61: FB1.2 43.57,4.41 v44.24,4.38
  Top 1.016: F1.1 48.57,25.73 v48.58,24.77
  Route15 1.016: v48.58,24.77 48.58,7.68 47.62,6.73 46.1,6.73 44.24,5.06 v44.24,4.38
N$18
  Top 0.256: IC1.54 12.5,34.9 C23.1 11.41,34.85 C22.2 11.13,34.87 10.73,36.01 10.16,36.01 R5.1
N$19
  Top 0.254: IC2.5 21.64,10.11 21.91,9.84 21.91,9.59 22.61,8.83 22.61,6.18 | Y1.1 25.92,6.02 25.72,6.22 22.65,6.22 22.61,6.18 | 22.61,6.18 C49.2
N$22
  Top 0.254: R23.2 D.C
N$56
  Top 0.813: U$3.3 43.38,44.32 U$4.P$1
N$91
  Top 0.254: R4.1 48.77,40.01 47.94,39.18 R3.1
  Top 0.406: C17.1 R3.1 | U$3.5 48.9,41.28 R4.1
N$93
  Top 0.406: R14.1 C30.1 47.94,32.13 48.77,32.13 R9.1 48.9,33.85 U$6.5
N$94
  Top 0.813: U$6.3 43.32,36.95 U$7.P$1
ODM
  Top 0.254: IC2.35 9.78,14.61 9.84,14.67 9.84,15.88 9.59,16.13 8.06,16.13 6.16,18.92 6.16,22.92 6.1,22.99 5.19,22.99 COM.P$3
ODP
  Top 0.254: IC2.36 9.87,14.12 10.22,14.48 10.22,16.13 9.72,16.57 8.26,16.57 6.6,19.05 6.6,23.24 6.22,23.62 5.2,23.62 COM.P$2
P0  (via drill 0.2, 0.3)
  Top 0.2: C1.1 v9.72,49.4
  Top 0.256: v15.24,37.78 14.73,37.91 IC1.48
  Bottom 0.2: v9.72,49.4 9.72,48.33 X101.1
  Bottom 0.256: X101.1 9.76,47.16 9.1,46.55 9.1,41.02 11.11,39.05 v15.24,37.78
P1  (via drill 0.2, 0.3)
  Top 0.2: C2.1 v11.05,49.4
  Top 0.256: v15.24,38.54 14.71,38.4 IC1.47
  Bottom 0.2: 10.35,46.42 10.39,46.48 | v11.05,49.4 11.05,48.3 X101.3
  Bottom 0.256: X101.3 11.03,47.1 10.39,46.48 10.39,41.47 12.7,39.43 14.54,39.43 15.24,38.73 v15.24,38.54
P2  (via drill 0.2 pad 0.3, 0.3)
  Top 0.2: C10.1 9.72,46.29 v9.84,46.42
  Top 0.254: IC1.45 11.9,39.4 v11.56,39.62
  Bottom 0.2: v9.84,46.42 9.84,44.8 X101.2
  Bottom 0.254: v11.56,39.62 9.72,41.34 9.72,44.67 X101.2
P3  (via drill 0.3, 0.3 pad 0.3)
  Top 0.2: C11.1 11.05,46.35 v11.11,46.42
  Top 0.254: IC1.44 13.06,39.9 v13.02,39.94
  Bottom 0.2: v11.11,46.42 11.11,44.8 X101.4
  Bottom 0.254: v13.02,39.94 10.84,41.8 10.84,42.59 11.05,42.8 X101.4
P4  (via drill 0.2, 0.3)
  Top 0.2: C3.1 v12.32,49.4
  Top 0.256: v13.02,40.7 13.32,40.4 IC1.43
  Bottom 0.2: v12.32,49.4 12.32,48.3 X101.5
  Bottom 0.256: X101.5 12.3,47.1 11.66,46.48 11.66,41.66 12.76,40.77 12.95,40.77 v13.02,40.7
P5  (via drill 0.2, 0.3)
  Top 0.2: C4.2 v13.53,49.4
  Top 0.256: v15.11,40.89 IC1.42
  Bottom 0.2: v13.53,49.4 13.53,48.33 X101.7
  Bottom 0.256: X101.7 13.57,47.16 13.08,46.67 13.08,46.18 12.93,45.91 12.93,43.12 12.51,42.67 12.51,42.16 12.89,41.85 14.8,41.85 15.11,41.59 v15.11,40.89
P6  (via drill 0.3, 0.3 pad 0.3)
  Top 0.2: C12.1 12.76,46.1 v12.51,46.42
  Top 0.254: IC1.41 13.08,41.4 v13.02,41.34
  Bottom 0.2: v12.51,46.42 12.51,45.97 12.45,45.91 12.45,44.87 X101.6
  Bottom 0.254: v13.02,41.34 12.83,41.34 12.76,41.4 12.11,41.93 12.11,42.97 12.32,43.18 X101.6
P7  (via drill 0.3, 0.3 pad 0.3)
  Top 0.2: C13.1 13.84,46.1 v13.65,46.42
  Top 0.254: IC1.39 13.04,42.4 v13.02,42.42
  Bottom 0.2: v13.65,46.42 13.65,45.09 13.53,44.96 13.53,44.76 X101.8
  Bottom 0.254: 13.57,42.97 X101.8
  Bottom 0.256: 13.57,42.97 v13.02,42.42
P8  (via drill 0.3)
  Top 0.256: v15.18,42.55 14.82,42.9 IC1.38
  Bottom 0.256: X101.9 14.84,47.1 14.21,46.48 14.21,43.5 v15.18,42.55
P9  (via drill 0.3 pad 0.3)
  Top 0.254: IC1.37 14.57,43.4 14.67,43.5 14.67,45.34 v16.13,46.55
  Bottom 0.254: v16.13,46.55 16.13,48.26 X101.11
P10  (via drill 0.3 pad 0.3)
  Top 0.254: IC1.34 16.85,44.47 v15.62,43.31
  Bottom 0.254: v15.62,43.31 15.05,43.31 14.86,43.5 14.86,44.7 X101.10
P11  (via drill 0.3 pad 0.3)
  Top 0.254: IC1.33 17.35,43.96 v16.13,42.8
  Bottom 0.254: v16.13,42.8 16.13,44.7 X101.12
P12  (via drill 0.3 pad 0.3)
  Top 0.254: IC1.32 17.85,45.97 v17.4,46.42
  Bottom 0.254: v17.4,46.42 17.4,48.26 X101.13
P13  (via drill 0.3 pad 0.3)
  Top 0.254: IC1.31 18.35,46.42 v18.29,46.48
  Bottom 0.254: v18.29,46.48 18.65,46.72 X101.15
P14  (via drill 0.3 pad 0.3)
  Top 0.254: IC1.29 19.35,44.56 v17.84,42.93
  Bottom 0.254: v17.84,42.93 17.4,43.31 17.4,44.7 X101.14
P15  (via drill 0.3 pad 0.3)
  Top 0.254: IC1.28 19.85,43.79 v18.67,42.93
  Bottom 0.254: v18.67,42.93 18.67,44.7 X101.16
P16  (via drill 0.3 pad 0.3)
  Top 0.254: IC1.26 20.85,45.89 v20.89,46.55
  Bottom 0.254: v20.89,46.55 19.92,46.76 X101.17
P17  (via drill 0.3 pad 0.3)
  Top 0.254: IC1.25 21.35,46.02 v21.72,46.55
  Bottom 0.254: v21.72,46.55 21.72,46.67 21.21,47.18 21.21,48.26 X101.19
P18  (via drill 0.3 pad 0.3)
  Top 0.254: IC1.24 21.85,44.52 v20.45,42.93
  Bottom 0.254: v20.45,42.93 20.45,43.18 19.94,43.69 19.94,44.7 X101.18
P19  (via drill 0.3 pad 0.3)
  Top 0.254: IC1.23 22.35,43.81 v21.21,42.93
  Bottom 0.254: v21.21,42.93 21.21,44.7 X101.20
P20  (via drill 0.3 pad 0.3)
  Top 0.254: IC1.22 22.85,46.11 v22.42,46.55
  Bottom 0.254: v22.42,46.55 22.42,48.24 X101.21
P21  (via drill 0.3 pad 0.3)
  Top 0.254: IC1.21 23.35,46.15 v23.75,46.55
  Bottom 0.254: v23.75,46.55 23.75,48.26 X101.23
P22  (via drill 0.3 pad 0.3)
  Top 0.254: IC1.20 23.85,44.11 v22.48,42.93
  Bottom 0.254: v22.48,42.93 22.48,44.7 X101.22
P23  (via drill 0.3 pad 0.3)
  Top 0.254: IC1.19 24.35,43.46 v23.75,42.93
  Bottom 0.254: v23.75,42.93 23.75,44.7 X101.24
P24  (via drill 0.3 pad 0.3)
  Top 0.254: IC1.18 24.85,46.44 v25.02,46.61
  Bottom 0.254: v25.02,46.61 25.02,48.26 X101.25
P25  (via drill 0.3 pad 0.3)
  Top 0.254: IC1.17 25.35,46.18 25.59,46.35 26.1,46.35 v26.23,46.61
  Bottom 0.254: v26.23,46.61 26.23,48.24 X101.27
P26  (via drill 0.3 pad 0.3)
  Top 0.254: IC1.16 25.85,43.69 v25.02,42.93
  Bottom 0.254: v25.02,42.93 25.02,44.7 X101.26
P27  (via drill 0.3 pad 0.3)
  Top 0.254: IC1.15 26.35,43.05 v26.23,42.93
  Bottom 0.254: v26.23,42.93 26.23,44.67 X101.28
P28  (via drill 0.3 pad 0.3)
  Top 0.254: IC1.12 27.85,46.25 v27.56,46.55
  Bottom 0.254: v27.56,46.55 27.56,48.26 X101.29
P29  (via drill 0.3 pad 0.3)
  Top 0.254: IC1.11 28.35,46.07 v28.83,46.55
  Bottom 0.254: v28.83,46.55 28.83,48.26 X101.31
P30  (via drill 0.3 pad 0.3)
  Top 0.254: IC1.10 28.85,44.22 v27.56,42.93
  Bottom 0.254: v27.56,42.93 27.56,44.7 X101.30
P31  (via drill 0.3 pad 0.3)
  Top 0.254: IC1.9 29.35,43.38 v28.83,42.93
  Bottom 0.254: v28.83,42.93 28.83,44.7 X101.32
P32  (via drill 0.3 pad 0.3)
  Top 0.254: IC1.8 29.85,46.41 v29.72,46.55
  Bottom 0.254: v29.72,46.55 30.08,46.97 X101.33
P33  (via drill 0.3 pad 0.3)
  Top 0.254: IC1.7 30.35,46.42 v30.48,46.55
  Bottom 0.254: v30.48,46.55 30.92,46.48 31.3,46.86 31.3,48.24 X101.35
P34  (via drill 0.3 pad 0.3)
  Top 0.254: IC1.4 31.85,44.36 30.35,42.86 30.61,42.74 v30.48,42.93
  Bottom 0.254: v30.48,42.93 30.48,43.24 30.1,43.62 30.1,44.7 X101.34
P35  (via drill 0.3 pad 0.3)
  Top 0.254: IC1.3 32.35,43.84 v31.43,42.93
  Bottom 0.254: v31.43,42.93 31.43,44.64 X101.36
P36  (via drill 0.3 pad 0.3)
  Top 0.254: IC1.2 32.85,46.46 v32.64,46.67
  Bottom 0.254: v32.64,46.67 32.64,48.26 X101.37
P37  (via drill 0.3 pad 0.3)
  Top 0.254: IC1.1 33.35,46.11 v33.85,46.61
  Bottom 0.254: v33.85,46.61 33.85,48.24 X101.39
P38  (via drill 0.3 pad 0.3)
  Top 0.254: IC1.144 33.05,43.4 v32.64,42.93
  Bottom 0.254: v32.64,42.93 32.64,44.7 X101.38
P39  (via drill 0.3 pad 0.3)
  Top 0.254: IC1.143 33.95,42.9 v33.91,42.86
  Bottom 0.254: v33.91,42.86 33.91,44.7 X101.40
P40  (via drill 0.3 pad 0.3)
  Top 0.254: IC1.142 35.99,42.4 36.07,42.48 36.07,45.53 v35.12,46.48
  Bottom 0.254: v35.12,46.48 35.12,48.24 X101.41
P41  (via drill 0.3 pad 0.3)
  Top 0.254: IC1.141 36.31,41.9 36.45,42.04 36.45,46.48 v36.39,46.55
  Bottom 0.254: v36.39,46.55 36.39,48.24 X101.43
P42  (via drill 0.3 pad 0.3)
  Top 0.254: IC1.139 34.16,40.9 v33.97,41.08
  Bottom 0.254: v33.97,41.08 35.16,42.27 X101.42
P43  (via drill 0.3 pad 0.3)
  Top 0.254: IC1.138 33.99,40.4 v33.97,40.39
  Bottom 0.254: v33.97,40.39 35.88,40.39 36.45,40.96 36.45,44.7 X101.44
P44  (via drill 0.3 pad 0.3)
  Top 0.254: IC1.137 36.41,39.9 37.72,41.21 v37.72,46.67
  Bottom 0.254: v37.72,46.67 37.72,48.26 X101.45
P45  (via drill 0.3 pad 0.3)
  Top 0.254: IC1.136 36.8,39.4 38.35,40.96 38.35,46.1 v38.92,46.67
  Bottom 0.254: v38.92,46.67 38.92,48.24 X101.47
P46  (via drill 0.3 pad 0.3)
  Top 0.254: IC1.135 37.5,38.9 v37.59,38.99
  Bottom 0.254: v37.59,38.99 37.59,44.61 X101.46
P47  (via drill 0.3 pad 0.3)
  Top 0.254: IC1.134 38.59,38.4 39.05,38.86 39.05,43.05 v39.12,43.12
  Bottom 0.254: v39.12,43.12 39.12,44.57 X101.48
PDM
  Top 0.254: IC2.44 6.43,10.11 6.03,9.65 5.22,9.65 U$10.P$2
PDP
  Top 0.254: IC2.45 6.68,9.6 6.03,8.95 U$10.P$3
RESET  (via drill 0.3)
  Top 0.254: IC1.66 15.42,28.9 v16.26,28.7 | IC2.2 17.93,8.61 v16.13,10.41
  Bottom 0.254: v16.26,28.7 16.26,25.46 15.24,22.61 15.24,11.3 v16.13,10.41
RX  (via drill 0.3)
  Top 0.254: IC1.62 13.83,30.92 v12.45,30.92 | IC2.43 9.57,10.62 10.03,10.16 v10.73,10.16
  Bottom 0.254: v12.45,30.92 12,30.86 8.32,28.83 8.32,27.11 8.6,26.42 8.6,21.23 10.73,19.86 v10.73,10.16 10.29,10.16 9.59,9.46 9.59,8.19 9.08,7.68 9.08,4.13 9.27,3.94 12.64,3.94 13.57,3 X100.8
SCK  (via drill 0.3)
  Top 0.254: v13.72,8.32 IC2.55 v13.72,3.87 | R12.2 U$8.6 v10.22,27.11 10.44,26.9 IC1.70
  Bottom 0.254: v13.72,8.32 13.65,9.72 12.64,10.86 12.64,20.83 10.92,22.23 10.92,26.61 v10.22,27.11 | v13.72,3.87 13.72,3.62 14.35,2.98 14.73,2.98 14.86,2.86 14.86,1.74 X100.10
SD0  (via drill 0.3)
  Top 0.254: IC1.105 31.85,25.12 v31.88,25.15
  Top 0.256: R31.1 v37.66,3.87
  Route15 0.256: v39.12,8.76 38.86,8.57 38.86,5.65 38.54,4.83 38.16,4.38 38.04,4.25 v37.66,3.87
  Bottom 0.254: v31.88,25.15 31.88,21.91 33.72,19.88 35.68,19.88 SD100.7 | 38.92,1.76 X100.48
  Bottom 0.256: 35.68,19.88 38.92,19.88 39.5,19.3 39.5,9.14 v39.12,8.76 | v37.66,3.87 38.1,3.87 38.92,3.05 38.92,1.76
SD1  (via drill 0.3)
  Top 0.254: IC1.106 32.41,24.99 v32.45,25.72
  Top 0.256: R32.1 v38.92,3.87
  Route15 0.256: v39.43,8.13 39.43,5.27 39.43,4.38 v38.92,3.87
  Bottom 0.254: v32.45,25.72 32.32,23.11 33.91,20.89 35.59,20.89 SD100.8 | 40.24,2.24 X100.50
  Bottom 0.256: 35.59,20.89 38.67,20.89 40.07,19.49 40.07,8.76 v39.43,8.13 | v38.92,3.87 39.62,3.17 39.62,2.86 40.24,2.24
SD2  (via drill 0.3)
  Top 0.254: IC1.99 28.85,25.12 v28.77,25.21
  Top 0.256: R27.1 v32.58,3.87
  Route15 0.256: v37.15,10.79 36.45,10.35 36.45,6.79 36.07,6.22 33.02,6.22 32.58,5.4 v32.58,3.87
  Bottom 0.254: v28.77,25.21 28.77,18.29 33.78,13.27 | 33.91,1.74 X100.40
  Bottom 0.256: 35.67,13.27 37.02,13.27 37.34,12.95 37.34,10.99 v37.15,10.79 | 33.78,13.27 35.67,13.27 | 35.67,13.27 SD100.1 | v32.58,3.87 33.08,3.87 33.91,3.05 33.91,1.74
SD3  (via drill 0.3)
  Top 0.254: IC1.101 29.85,25.14 v29.78,25.21
  Top 0.256: R28.1 v33.85,3.87
  Route15 0.256: v37.66,10.35 37.15,9.91 37.15,6.22 36.51,5.78 33.97,5.78 33.85,5.14 v33.85,3.87
  Bottom 0.254: v29.78,25.21 29.78,19.18 33.78,14.41 | 35.68,14.41 SD100.2 | 35.18,1.74 X100.42
  Bottom 0.256: 35.68,14.41 37.47,14.41 37.91,13.97 37.91,10.6 v37.66,10.35 | 33.78,14.41 34.25,14.39 SD100.2 | v33.85,3.87 34.29,3.87 35.18,2.98 35.18,1.74
SDCLK  (via drill 0.3)
  Top 0.254: IC1.104 31.35,25.7 v31.37,25.72
  Top 0.256: R30.1 v36.39,3.87
  Route15 0.256: v38.73,9.34 38.42,9.08 38.42,5.91 37.21,4.7 36.39,4.45 v36.39,3.87
  Bottom 0.254: v31.37,25.72 31.37,20.77 33.78,17.72 35.67,17.72 SD100.5 35.72,17.72 | X100.46 37.72,1.74
  Bottom 0.256: 35.72,17.72 38.42,17.72 38.92,17.21 38.92,9.53 v38.73,9.34 | v36.39,3.87 36.83,3.87 37.72,2.98 37.72,1.74
SDCMD  (via drill 0.3)
  Top 0.256: IC1.102 30.35,25.52 v30.1,25.97 | R29.1 v35.12,3.87
  Route15 0.256: v38.35,9.97 37.91,9.53 37.91,6.1 36.89,5.27 35.31,5.27 35.12,4.45 v35.12,3.87
  Bottom 0.254: 36.45,1.74 X100.44
  Bottom 0.256: v30.1,25.97 30.1,25.65 30.42,25.27 30.35,20.26 33.91,15.49 SD100.3 35.63,15.56 37.72,15.56 38.42,14.86 38.42,10.03 v38.35,9.97 | v35.12,3.87 35.62,3.87 36.45,3.05 36.45,1.74
STATUS
  Top 0.254: R22.1 5.93,17.08 6.03,17.08 7.3,15.11 IC2.34
TCK+
  Top 0.2: U$5.P$11 8.3,38.27 10.73,40.83 10.73,42.48 10.86,42.61 11.62,42.61 12.7,43.69 12.7,44.32 C12.2
TCK-
  Top 0.2: U$5.P$12 8.41,37.87 11.11,40.64 11.11,41.97 11.37,42.23 11.87,42.23 13.4,43.94 13.84,44.07 C13.2
TD0+
  Top 0.2: U$5.P$8 8.29,39.47 9.97,41.27 9.97,43.05 10.16,43.37 11.24,43.37 11.62,43.88 11.62,46.99 C3.2
TD0-
  Top 0.2: U$5.P$9 8.46,39.07 10.35,41.02 10.35,42.8 10.48,42.99 11.49,42.99 12,43.69 12,46.67 12.38,47.05 12.95,47.05 C4.1
TD1+
  Top 0.2: U$5.P$5 8.35,40.67 9.21,41.59 9.21,43.88 C10.2
TD1-
  Top 0.2: U$5.P$6 8.46,40.27 9.59,41.47 9.59,43.31 9.84,43.75 10.86,43.75 10.99,44.01 10.99,44.26 C11.2
TD2+
  Top 0.2: U$5.P$2 8.34,41.87 8.51,42.04 8.51,46.55 C1.2
TD2-
  Top 0.2: U$5.P$3 8.45,41.47 8.85,41.91 8.85,46.23 9.72,46.99 10.41,46.99 C2.2
TDI
  Bottom 0.65: 23.75,1.74 X100.24
TX  (via drill 0.3)
  Top 0.254: IC1.61 13.05,31.4 v12.95,31.5 | IC2.42 9.98,11.1 v10.22,10.79
  Bottom 0.254: v12.95,31.5 12.26,31.43 7.87,29.21 7.87,26.99 8.15,26.42 8.15,20.66 10.22,19.62 v10.22,10.79 10.22,10.67 9.21,9.65 9.21,8.38 8.7,7.87 8.7,3.87 9.02,3.56 12,3.56 12.26,3.37 12.26,1.76 X100.6
UDQM  (via drill 0.3)
  Top 0.254: IC1.94 26.35,24.95 v26.61,25.21 | v34.48,11.75 36.7,11.75 39.94,14.67 39.94,17.82 IC3.36
  Bottom 0.254: v26.61,25.21 26.61,19.62 v34.48,11.75
VBUS
  Top 0.406: U$10.P$1 5.68,10.38
  Top 0.61: 5.68,10.38 6.22,10.99 6.22,13.09 D2.A
VCAP
  Top 0.254: IC2.30 11.73,18.68 C59.1
VCC  (via drill 0.3)
  Top 0.254: R5.2 9.97,38.01 | 9.97,38.01 C20.1 10.54,38.02 | v9.97,38.67 9.97,38.01
  Top 0.256: C37.1 25.99,22.86 25.4,22.86 25.35,22.91 IC1.92 25.35,24.81 24.7,25.46 v24.7,26.16 | C32.2 36.9,26.9 IC1.111 33.63,26.9 v33.59,26.86 | C8.1 20.35,47.09 IC1.27 20.35,43.72 19.56,42.93 v19.56,41.72 | C14.1 12.38,41.9 IC1.40 16.84,41.9 v17.21,41.53 | R6.1 38.95,36.22 v38.99,36.26
  Top 0.406: C16.1 46.29,39.62 R3.2 C17.2
  Top 0.813: C16.1 44.41,41.31 44.2,41.53 43.37,41.53 U$4.P$2
  Top 1.016: U$4.P$2 43.37,42.61 v41.59,42.61
  Route2 0.256: v17.21,41.53 17.21,41.47 | v19.56,41.72 19.37,41.72
  other vias: 42.42,42.61 43.24,42.61
  pour Route15: 16.57,41.78 16.57,38.86 9.65,38.99 9.65,38.42 13.34,36.58 18.1,36.58 23.3,25.91 25.34,25.78 25.53,26.23 34.1,26.23 34.1,27.37 31.69,27.5 31.69,35.43 32.83,37.66 34.23,37.66 36.32,35.31 39.88,35.31 39.88,41.34 43.56,41.34 43.56,42.74 43.31,43.12 35.05,43.12 34.04,42.1 16.89,42.1
VDD_ADC
  Top 0.254: IC2.13 21.05,14.12 21.21,13.97 21.61,13.97 C46.2 22.29,14.3 22.29,15.43 22.28,17.16 21.97,17.4 R24.2
VSCL  (via drill 0.2, 0.3)
  Top 0.2: U$5.P$15 8.6,36.67 v8.7,36.77 8.95,36.51 9.14,36.39 9.27,36.39 10.03,35.37 R8.2
  Top 0.254: v17.72,36.32 17.72,27.3 15.24,24.83 15.24,21.78 12.72,19.27 IC2.28
  Bottom 0.254: v8.7,36.77 9.27,36.77 9.65,36.39 16.76,36.39 v17.72,36.32
VSDA  (via drill 0.2, 0.3)
  Top 0.2: U$5.P$16 8.31,36.27 8.51,36.26 8.64,36.2 v8.89,35.94
  Top 0.254: v17.21,35.75 17.21,27.62 14.86,25.27 14.86,21.97 12.22,19.33 IC2.29 | R7.2 9.14,35.69 v8.89,35.94
  Bottom 0.254: v8.89,35.94 16.57,35.94 v17.21,35.75
VUSB  (via drill 0.3, 0.4, 0.5)
  Top 0.2: U$5.P$18 8.47,35.47
  Top 0.254: R8.1 R7.1 8.64,33.97 | 8.47,35.47 8.51,35.43 8.51,34.1 8.64,33.97 | v8.64,32.87 8.64,33.97
  Top 0.305: C62.2 41.21,2.92 41.68,2.45
  Top 0.406: v3.11,14.48 2.96,14.2 3.24,14.06 v3.11,13.84
  Top 0.61: FB1.1 41.93,2.71 41.68,2.45 v41.32,2.1
  Top 0.813: D2.C 2.96,14.2
  Route15 0.406: v3.11,14.48 3.11,14.73 1.78,15.81 1.78,18.35 1.11,19.19 1.11,26.77 1.43,27.15 1.84,27.56 4.13,27.56 4.45,26.99 v7.18,26.99 8.64,28.45 v8.64,32.87
  Route15 1.016: v3.11,13.84 5.91,12.32 5.91,3.11 6.29,2.1 26.29,2.16 | 26.29,2.16 v41.32,2.1 | v26.29,3.17 26.29,2.16
  Bottom 0.406: D100.C v7.18,26.99
  Bottom 0.61: 26.27,2.92 v26.29,3.17
  Bottom 0.813: X100.28 26.27,2.92
WP  (via drill 0.3)
  Top 0.254: IC2.53 12.72,7.34 12.7,7.37 v12.7,8.13 | IC1.64 12.39,29.9 v12.45,29.91 | v9.72,22.23 10.16,22.23 | 10.16,22.23 10.16,21.69 R18.2 | 10.16,22.23 10.16,23.69 U$8.3
  Bottom 0.254: v12.7,8.13 12.45,9.53 11.68,10.67 11.68,20.32 9.91,21.84 9.72,22.04 v9.72,22.23 9.78,25.72 9.59,26.48 9.59,28.32 10.67,29.08 v12.45,29.91

## Text on the board
Route2: G
Route15: P
tPlace: U$4 | U$3 | U$5 | U$7 | U$6 | F1 | |< | Copyright 2018 / Alan Wood / @folknology / www.mystorm.uk | |< | Y1 | U$11
bPlace: |<
tNames: V1.2-HX40-4/16Mb / 22 May 2019 | Ice | Core | COM | PRG | IC3